# EAGLE board HW_RPI_DAQ (EAGLE 9.2.1), part 1 of 4
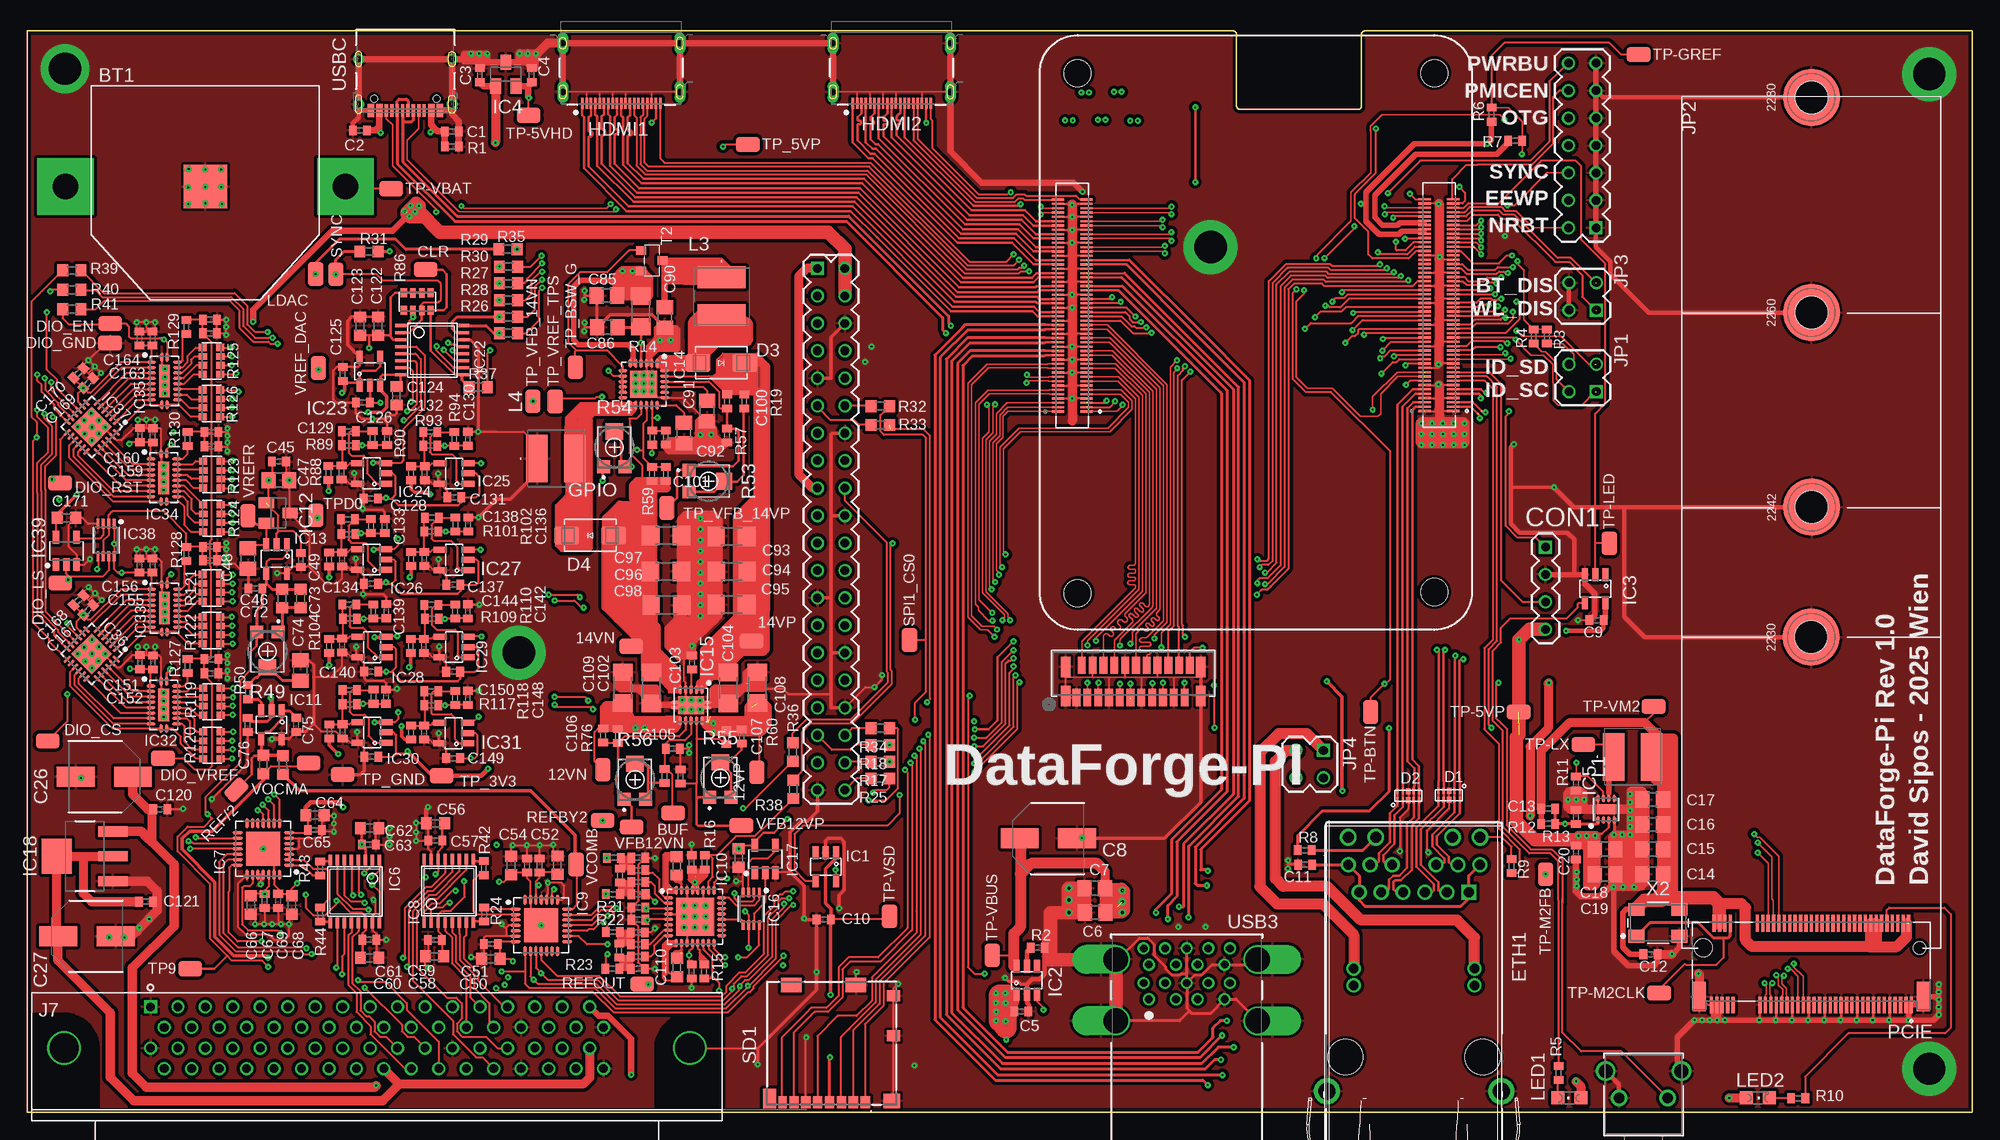
[diagram p8: board, top side]
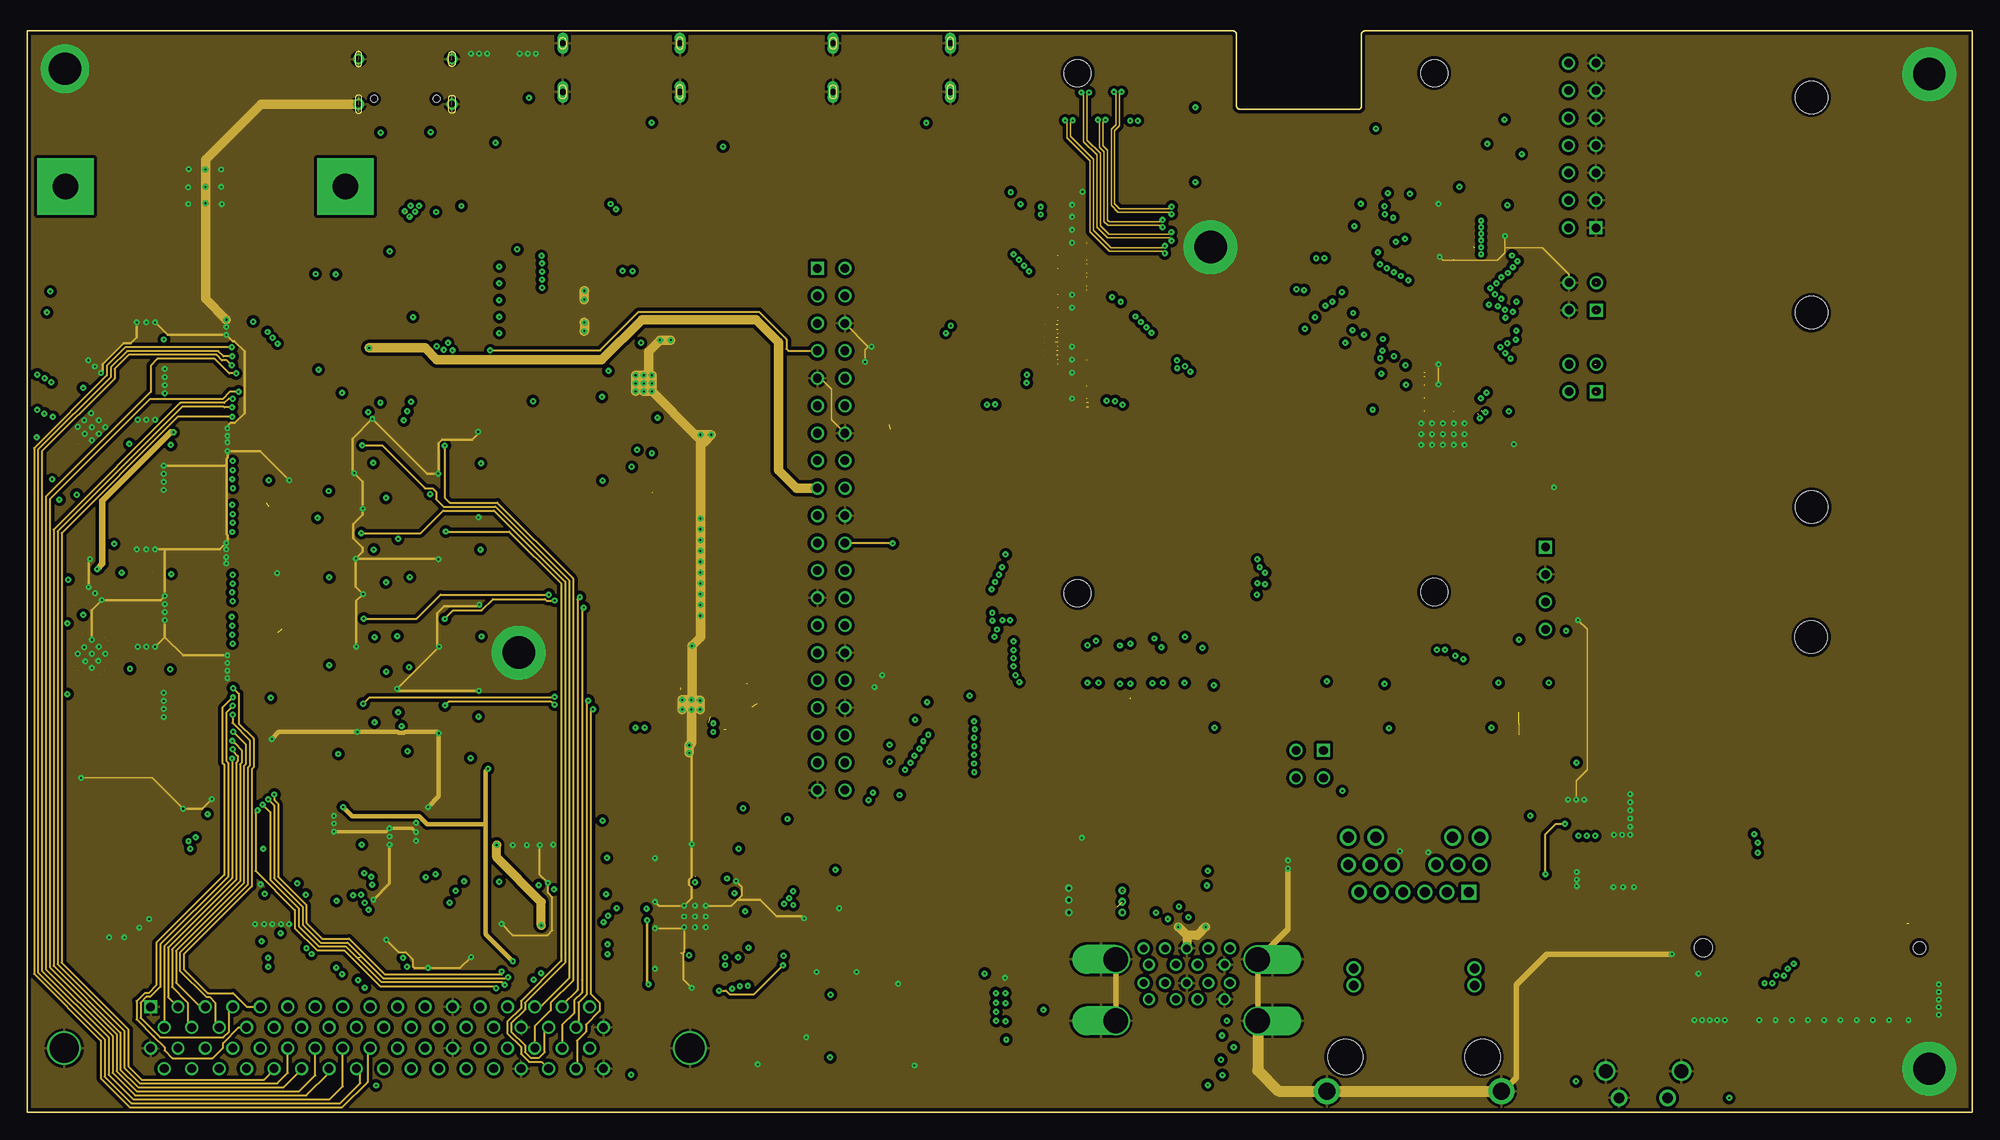
[diagram p9: board, inner layer Route2]
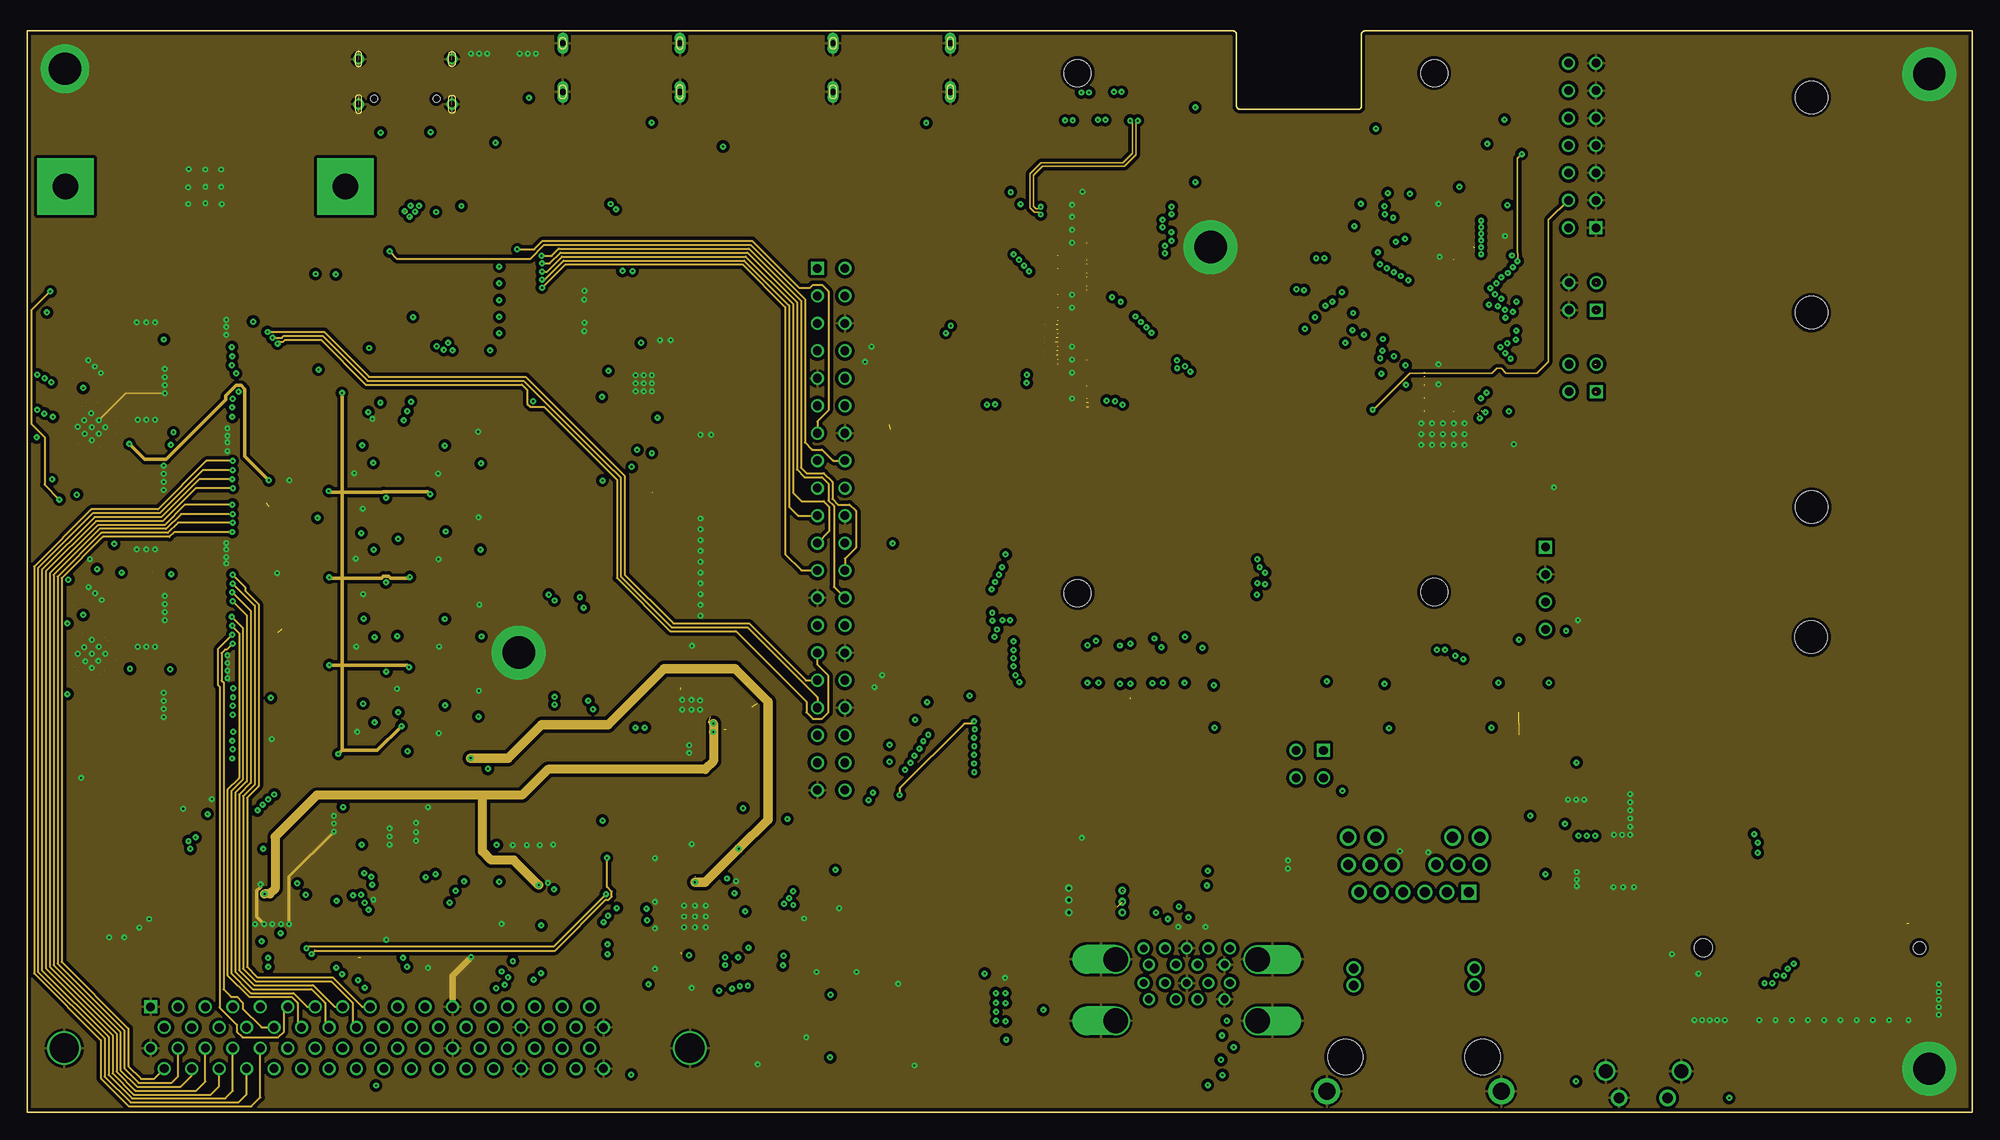
[diagram p10: board, inner layer Route15]
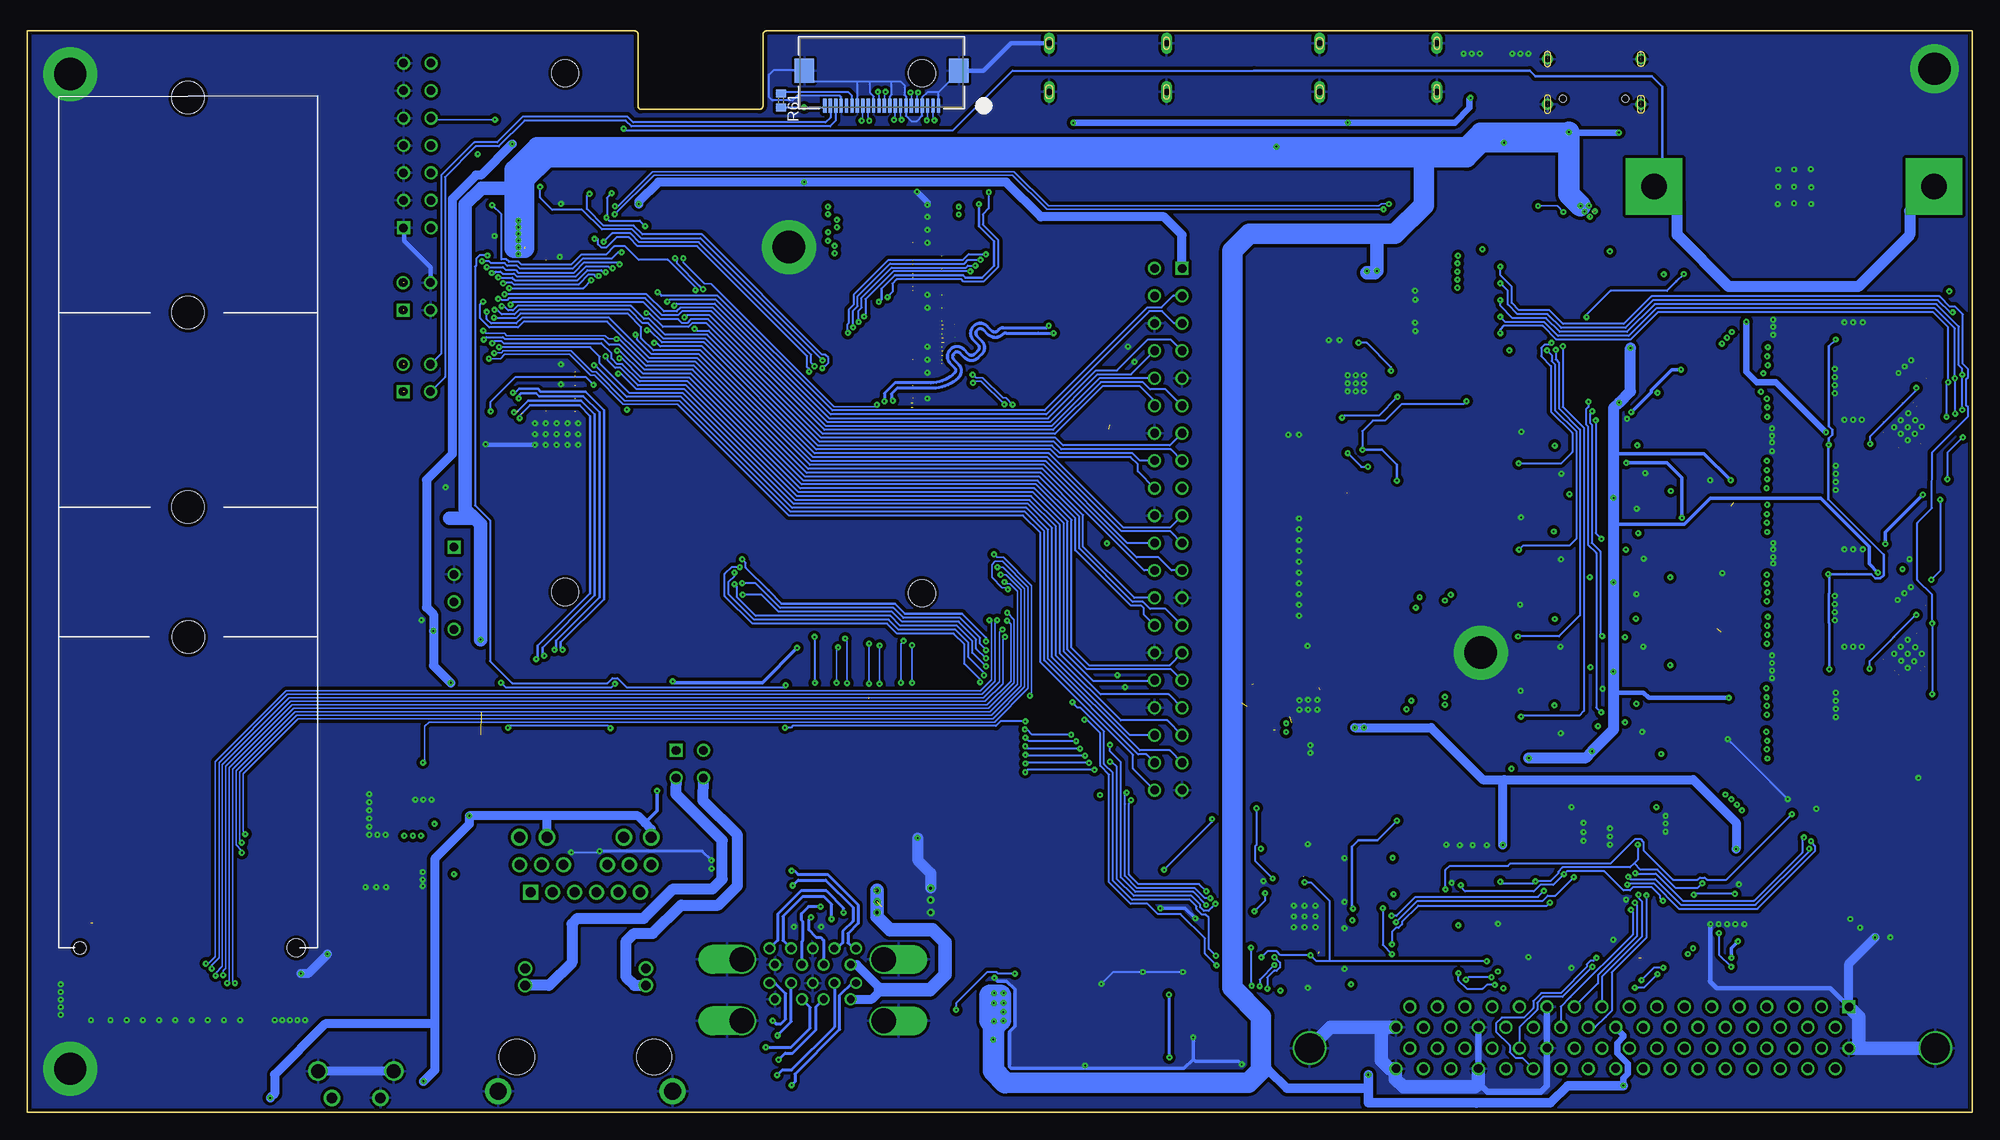
[diagram p11: board, bottom side, seen from below]

Size 180 x 100 mm. Coordinates in mm from the lower left corner, seen from the top.
Outline: 0,0 0,100 111.56,100 arc-90 111.9,99.66 111.9,93.09 arc90 112.24,92.75 123.2,92.75 arc90 123.45,93 123.45,99.66 arc-90 123.79,100 180,100 180,0 0,0
Copper layers (1+2*15+16): Top 0.035mm / dielectric 0.2104mm / Route2 0.0152mm / dielectric 1.065mm / Route15 0.0152mm / dielectric 0.2104mm / Bottom 0.035mm
Design rules "jlcpcb-4layers *": minimum track width 0.16mm, minimum drill 0.15mm, track to track 0.16mm, track to pad 0.16mm, pad to pad 0.16mm, via to via 0.16mm, smd to smd 0.16mm, copper to edge 0.2mm, drill to drill 0.2mm, minimum pad ring 0.2mm, minimum via ring 0.2mm, stop-mask expansion 0.05mm, vias tented up to drill 16mil, thermal gap 10mil
Net classes: 1 50R_DIFFPAIR: width 0.4 mm, drill 0.15 mm, clearance 0.203 mm; 2 90R_DIFFPAIR: width 0.286 mm, drill 0.15 mm, clearance 0.203 mm; 3 100R_DIFFPAIR: width 0.221 mm, drill 0.15 mm, clearance 0.203 mm
Holes 2.5 mm at 97.2,96.1 130.2,96.1 97.2,48 130.2,48.1

## Footprints (pad centres in the part's own frame; a part is rotated, then mirrored left to right if it is on the bottom)
TP = smd 2.2 x 1.4: TP 0,0
WA-SMSI_9774010243 = smd 5.3 x 5.3: 1 0,0 | hole 3: 0,0
79523141 = smd 4 x 4: N 0,0 | drill 2.35 pad 5.2 square: P1 -12.95,0; P2 12.95,0
0402 = smd 0.7 x 0.9: 1 -0.65,0; 2 0.65,0
0805 = smd 1.3 x 1.5: 1 -0.95,0; 2 0.95,0
100UF-16V = smd 3.5 x 1.85: 1 -2.65,0; 2 2.65,0
0603 = smd 1 x 1.1: 1 -0.85,0; 2 0.85,0
1206 = smd 1.6 x 1.803: 1 -1.422,0; 2 1.422,0
1X4 = drill 0.8 square: 1 0,3.81 | drill 0.8: 2 0,1.27; 3 0,-1.27; 4 0,-3.81
USON = smd 0.57 x 0.2: 1 -0.4,1; 2 -0.4,0.5; 4 -0.4,-0.5; 5 -0.4,-1; 6 0.435,-1; 7 0.435,-0.5; 9 0.435,0.5; 10 0.435,1 | smd 0.57 x 0.4: 3 -0.4,0; 8 0.435,0
SMA = smd 2.28 x 1.66: A 2.165,0; C -2.165,0
MAGJACK_POE = drill 1.02 pad 1.53: 17 6.11,15.24; 18 3.57,15.24; 19 -3.54,15.24; 20 -6.08,15.24 | drill 0.9 pad 1.4: CT1 -6.08,12.7; CT2 -5.07,10.16; CT4 6.1,12.7; TD1+ -4.05,12.7; TD1- -2.02,12.7; TD2+ -1.01,10.16; TD2- -3.04,10.16; TD3+ 1.02,10.16; TD3- 3.05,10.16; TD4+ 4.07,12.7; TD4- 2.04,12.7 | drill 0.9 pad 1.4 square: CT3 5.08,10.16 | drill 1.6 pad 2.4: MH3 -8.06,-8.25; MH4 8.08,-8.25 | drill 0.9 pad 1.25: VC1 5.6,3.1; VC2 -5.58,3.1; VC3 5.6,1.53; VC4 -5.58,1.53 | hole 3.25: -6.34,-5.08; 6.36,-5.08
2X20 = drill 0.8 square: 1 -1.27,24.13 | drill 0.8: 2 1.27,24.13; 3 -1.27,21.59; 4 1.27,21.59; 5 -1.27,19.05; 6 1.27,19.05; 7 -1.27,16.51; 8 1.27,16.51; 9 -1.27,13.97; 10 1.27,13.97; 11 -1.27,11.43; 12 1.27,11.43; 13 -1.27,8.89; 14 1.27,8.89; 15 -1.27,6.35; 16 1.27,6.35; 17 -1.27,3.81; 18 1.27,3.81; 19 -1.27,1.27; 20 1.27,1.27; 21 -1.27,-1.27; 22 1.27,-1.27; 23 -1.27,-3.81; 24 1.27,-3.81; 25 -1.27,-6.35; 26 1.27,-6.35; 27 -1.27,-8.89; 28 1.27,-8.89; 29 -1.27,-11.43; 30 1.27,-11.43; 31 -1.27,-13.97; 32 1.27,-13.97; 33 -1.27,-16.51; 34 1.27,-16.51; 35 -1.27,-19.05; 36 1.27,-19.05; 37 -1.27,-21.59; 38 1.27,-21.59; 39 -1.27,-24.13; 40 1.27,-24.13
685119136923 = smd 0.23 x 1: 1 3.6,1.05; 2 3.2,1.05; 3 2.8,1.05; 4 2.4,1.05; 5 2,1.05; 6 1.6,1.05; 7 1.2,1.05; 8 0.8,1.05; 9 0.4,1.05; 10 0,1.05; 11 -0.4,1.05; 12 -0.8,1.05; 13 -1.2,1.05; 14 -1.6,1.05; 15 -2,1.05; 16 -2.4,1.05; 17 -2.8,1.05; 18 -3.2,1.05; 19 -3.6,1.05 | drill 0.6 pad 0.9 long: S1 5.425,0; S2 -5.425,0 | drill 0.6 pad 0.8 long: S3 -5.425,-4.5; S4 5.425,-4.5
SOT23-5 = smd 0.55 x 1.2: 1 -0.95,-1.3; 2 0,-1.3; 3 0.95,-1.3; 4 0.95,1.3; 5 -0.95,1.3
SOT23-6 = smd 0.55 x 1.2: 1 -0.95,-1.3; 2 0,-1.3; 3 0.95,-1.3; 4 0.95,1.3; 5 0,1.3; 6 -0.95,1.3
SOT23 = smd 1 x 1.4: 1 -0.95,-1.1; 2 0.95,-1.1; 3 0,1.1
SON50P201X201X56-9T90X170N = smd 0.715 x 0.27: 1 -1.001,0.75; 2 -1.001,0.25; 3 -1.001,-0.25; 4 -1.001,-0.75; 5 1.001,-0.75; 6 1.001,-0.25; 7 1.001,0.25; 8 1.001,0.75 | smd 0.9 x 1.7: 9 0,0
TSSOP2 = smd 0.305 x 0.991: 1 -2.275,-2.918; 2 -1.625,-2.918; 3 -0.975,-2.918; 4 -0.325,-2.918; 5 0.325,-2.918; 6 0.975,-2.918; 7 1.625,-2.918; 8 2.275,-2.918; 9 2.275,2.918; 10 1.625,2.918; 11 0.975,2.918; 12 0.325,2.918; 13 -0.325,2.918; 14 -0.975,2.918; 15 -1.625,2.918; 16 -2.275,2.918
QFN50P500X500X75-29T314N = smd 0.968 x 0.27: 1 -2.381,1.5; 2 -2.381,1; 3 -2.381,0.5; 4 -2.381,0; 5 -2.381,-0.5; 6 -2.381,-1; 7 -2.381,-1.5; 15 2.381,-1.5; 16 2.381,-1; 17 2.381,-0.5; 18 2.381,0; 19 2.381,0.5; 20 2.381,1; 21 2.381,1.5 | smd 0.27 x 0.968: 8 -1.5,-2.381; 9 -1,-2.381; 10 -0.5,-2.381; 11 0,-2.381; 12 0.5,-2.381; 13 1,-2.381; 14 1.5,-2.381; 22 1.5,2.381; 23 1,2.381; 24 0.5,2.381; 25 0,2.381; 26 -0.5,2.381; 27 -1,2.381; 28 -1.5,2.381 | smd 3.14 x 3.14: 29 0,0
VQFN32-5X5 = smd 0.86 x 0.27: 1 -2.435,1.75; 2 -2.435,1.25; 3 -2.435,0.75; 4 -2.435,0.25; 5 -2.435,-0.25; 6 -2.435,-0.75; 7 -2.435,-1.25; 8 -2.435,-1.75; 17 2.435,-1.75; 18 2.435,-1.25; 19 2.435,-0.75; 20 2.435,-0.25; 21 2.435,0.25; 22 2.435,0.75; 23 2.435,1.25; 24 2.435,1.75 | smd 0.27 x 0.86: 9 -1.75,-2.435; 10 -1.25,-2.435; 11 -0.75,-2.435; 12 -0.25,-2.435; 13 0.25,-2.435; 14 0.75,-2.435; 15 1.25,-2.435; 16 1.75,-2.435; 25 1.75,2.435; 26 1.25,2.435; 27 0.75,2.435; 28 0.25,2.435; 29 -0.25,2.435; 30 -0.75,2.435; 31 -1.25,2.435; 32 -1.75,2.435 | smd 3.5 x 3.5: 33 0,0
VQFN24-4X4-THERMAL2.5X2.5 = smd 0.86 x 0.27: 1 -1.935,1.25; 2 -1.935,0.75; 3 -1.935,0.25; 4 -1.935,-0.25; 5 -1.935,-0.75; 6 -1.935,-1.25; 13 1.935,-1.25; 14 1.935,-0.75; 15 1.935,-0.25; 16 1.935,0.25; 17 1.935,0.75; 18 1.935,1.25 | smd 0.27 x 0.86: 7 -1.25,-1.935; 8 -0.75,-1.935; 9 -0.25,-1.935; 10 0.25,-1.935; 11 0.75,-1.935; 12 1.25,-1.935; 19 1.25,1.935; 20 0.75,1.935; 21 0.25,1.935; 22 -0.25,1.935; 23 -0.75,1.935; 24 -1.25,1.935 | smd 2.5 x 2.5: 25 0,0
WSON10-3X3 = smd 0.86 x 0.264: 1 -1.435,1; 2 -1.435,0.5; 3 -1.435,0; 4 -1.435,-0.5; 5 -1.435,-1; 6 1.435,-1; 7 1.435,-0.5; 8 1.435,0; 9 1.435,0.5; 10 1.435,1 | smd 1.65 x 2.4: PAD 0,0 | smd 0.264 x 0.86: PAD1 -0.25,1.435; PAD2 -0.25,-1.435; PAD3 0.25,-1.435; PAD4 0.25,1.435
SOP50P310X90-8N = smd 0.923 x 0.268: 1 -1.503,0.75; 2 -1.503,0.25; 3 -1.503,-0.25; 4 -1.503,-0.75; 5 1.503,-0.75; 6 1.503,-0.25; 7 1.503,0.25; 8 1.503,0.75
SOT95P280X145-5N = smd 1.186 x 0.597: 1 -1.264,0.95; 2 -1.264,0; 3 -1.264,-0.95; 4 1.264,-0.95; 5 1.264,0.95
SOT230 = smd 0.95 x 2.75: 1 -2.3,-2.6; 2 0,-2.6; 3 2.3,-2.6 | smd 3.25 x 2.75: 4 0,2.6
TSSOP16 = smd 0.305 x 0.991: 1 -2.275,-2.918; 2 -1.625,-2.918; 3 -0.975,-2.918; 4 -0.325,-2.918; 5 0.325,-2.918; 6 0.975,-2.918; 7 1.625,-2.918; 8 2.275,-2.918; 9 2.275,2.918; 10 1.625,2.918; 11 0.975,2.918; 12 0.325,2.918; 13 -0.325,2.918; 14 -0.975,2.918; 15 -1.625,2.918; 16 -2.275,2.918
VQFN20 = smd 0.27 x 0.838: 1 -0.25,2.196; 10 -0.25,-2.196; 11 0.25,-2.196; 20 0.25,2.196 | smd 0.838 x 0.27: 2 -1.196,1.75; 3 -1.196,1.25; 4 -1.196,0.75; 5 -1.196,0.25; 6 -1.196,-0.25; 7 -1.196,-0.75; 8 -1.196,-1.25; 9 -1.196,-1.75; 12 1.196,-1.75; 13 1.196,-1.25; 14 1.196,-0.75; 15 1.196,-0.25; 16 1.196,0.25; 17 1.196,0.75; 18 1.196,1.25; 19 1.196,1.75 | smd 1 x 3: PAD 0,0
QFN50P400X400X100-25T265 = smd 0.811 x 0.264: 1 -1.951,1.25; 2 -1.951,0.75; 3 -1.951,0.25; 4 -1.951,-0.25; 5 -1.951,-0.75; 6 -1.951,-1.25; 13 1.951,-1.25; 14 1.951,-0.75; 15 1.951,-0.25; 16 1.951,0.25; 17 1.951,0.75; 18 1.951,1.25 | smd 0.264 x 0.811: 7 -1.25,-1.951; 8 -0.75,-1.951; 9 -0.25,-1.951; 10 0.25,-1.951; 11 0.75,-1.951; 12 1.25,-1.951; 19 1.25,1.951; 20 0.75,1.951; 21 0.25,1.951; 22 -0.25,1.951; 23 -0.75,1.951; 24 -1.25,1.951 | smd 2.65 x 2.65: 25 0,0
AMPHENOL_10164227-1001A1RLF = smd 0.2 x 1.14: 1 9.8,1.32; 2 9.8,-1.32; 3 9.4,1.32; 4 9.4,-1.32; 5 9,1.32; 6 9,-1.32; 7 8.6,1.32; 8 8.6,-1.32; 9 8.2,1.32; 10 8.2,-1.32; 11 7.8,1.32; 12 7.8,-1.32; 13 7.4,1.32; 14 7.4,-1.32; 15 7,1.32; 16 7,-1.32; 17 6.6,1.32; 18 6.6,-1.32; 19 6.2,1.32; 20 6.2,-1.32; 21 5.8,1.32; 22 5.8,-1.32; 23 5.4,1.32; 24 5.4,-1.32; 25 5,1.32; 26 5,-1.32; 27 4.6,1.32; 28 4.6,-1.32; 29 4.2,1.32; 30 4.2,-1.32; 31 3.8,1.32; 32 3.8,-1.32; 33 3.4,1.32; 34 3.4,-1.32; 35 3,1.32; 36 3,-1.32; 37 2.6,1.32; 38 2.6,-1.32; 39 2.2,1.32; 40 2.2,-1.32; 41 1.8,1.32; 42 1.8,-1.32; 43 1.4,1.32; 44 1.4,-1.32; 45 1,1.32; 46 1,-1.32; 47 0.6,1.32; 48 0.6,-1.32; 49 0.2,1.32; 50 0.2,-1.32; 51 -0.2,1.32; 52 -0.2,-1.32; 53 -0.6,1.32; 54 -0.6,-1.32; 55 -1,1.32; 56 -1,-1.32; 57 -1.4,1.32; 58 -1.4,-1.32; 59 -1.8,1.32; 60 -1.8,-1.32; 61 -2.2,1.32; 62 -2.2,-1.32; 63 -2.6,1.32; 64 -2.6,-1.32; 65 -3,1.32; 66 -3,-1.32; 67 -3.4,1.32; 68 -3.4,-1.32; 69 -3.8,1.32; 70 -3.8,-1.32; 71 -4.2,1.32; 72 -4.2,-1.32; 73 -4.6,1.32; 74 -4.6,-1.32; 75 -5,1.32; 76 -5,-1.32; 77 -5.4,1.32; 78 -5.4,-1.32; 79 -5.8,1.32; 80 -5.8,-1.32; 81 -6.2,1.32; 82 -6.2,-1.32; 83 -6.6,1.32; 84 -6.6,-1.32; 85 -7,1.32; 86 -7,-1.32; 87 -7.4,1.32; 88 -7.4,-1.32; 89 -7.8,1.32; 90 -7.8,-1.32; 91 -8.2,1.32; 92 -8.2,-1.32; 93 -8.6,1.32; 94 -8.6,-1.32; 95 -9,1.32; 96 -9,-1.32; 97 -9.4,1.32; 98 -9.4,-1.32; 99 -9.8,1.32; 100 -9.8,-1.32
FH12-22S-0.5SH = smd 0.711 x 1.6: 1 5.251,2.244; 2 4.751,-0.756; 3 4.251,2.244; 4 3.751,-0.756; 5 3.251,2.244; 6 2.751,-0.756; 7 2.251,2.244; 8 1.75,-0.756; 9 1.25,2.244; 10 0.75,-0.756; 11 0.25,2.244; 12 -0.25,-0.756; 13 -0.75,2.244; 14 -1.25,-0.756; 15 -1.75,2.244; 16 -2.251,-0.756; 17 -2.751,2.244; 18 -3.251,-0.756; 19 -3.751,2.244; 20 -4.251,-0.756; 21 -4.751,2.244; 22 -5.251,-0.756 | smd 0.889 x 1.905: 23 -6.25,2.091; 24 6.25,2.091; 25 -6.25,-0.604; 26 6.25,-0.604
CONN_FH12-22S-0.5SH(55)_HIR = smd 0.305 x 1.295: 1 -5.25,3.05; 2 -4.75,3.05; 3 -4.25,3.05; 4 -3.75,3.05; 5 -3.25,3.05; 6 -2.75,3.05; 7 -2.25,3.05; 8 -1.75,3.05; 9 -1.25,3.05; 10 -0.75,3.05; 11 -0.25,3.05; 12 0.25,3.05; 13 0.75,3.05; 14 1.25,3.05; 15 1.75,3.05; 16 2.25,3.05; 17 2.75,3.05; 18 3.25,3.05; 19 3.75,3.05; 20 4.25,3.05; 21 4.75,3.05; 22 5.25,3.05 | smd 1.803 x 2.21: 23 -7.15,-0.2; 24 7.15,-0.2
2-5174225-5 = drill 0.8 square: 1 0,0 | drill 0.8: 2 1.27,-1.905; 3 2.54,0; 4 3.81,-1.905; 5 5.08,0; 6 6.35,-1.905; 7 7.62,0; 8 8.89,-1.905; 9 10.16,0; 10 11.43,-1.905; 11 12.7,0; 12 13.97,-1.905; 13 15.24,0; 14 16.51,-1.905; 15 17.78,0; 16 19.05,-1.905; 17 20.32,0; 18 21.59,-1.905; 19 22.86,0; 20 24.13,-1.905; 21 25.4,0; 22 26.67,-1.905; 23 27.94,0; 24 29.21,-1.905; 25 30.48,0; 26 31.75,-1.905; 27 33.02,0; 28 34.29,-1.905; 29 35.56,0; 30 36.83,-1.905; 31 38.1,0; 32 39.37,-1.905; 33 40.64,0; 34 41.91,-1.905; 35 0,-3.81; 36 1.27,-5.715; 37 2.54,-3.81; 38 3.81,-5.715; 39 5.08,-3.81; 40 6.35,-5.715; 41 7.62,-3.81; 42 8.89,-5.715; 43 10.16,-3.81; 44 11.43,-5.715; 45 12.7,-3.81; 46 13.97,-5.715; 47 15.24,-3.81; 48 16.51,-5.715; 49 17.78,-3.81; 50 19.05,-5.715; 51 20.32,-3.81; 52 21.59,-5.715; 53 22.86,-3.81; 54 24.13,-5.715; 55 25.4,-3.81; 56 26.67,-5.715; 57 27.94,-3.81; 58 29.21,-5.715; 59 30.48,-3.81; 60 31.75,-5.715; 61 33.02,-3.81; 62 34.29,-5.715; 63 35.56,-3.81; 64 36.83,-5.715; 65 38.1,-3.81; 66 39.37,-5.715; 67 40.64,-3.81; 68 41.91,-5.715 | drill 2.7: MH1 -7.995,-3.81; MH2 49.905,-3.81
2X2 = drill 0.8 square: 1 -1.27,1.27 | drill 0.8: 2 1.27,1.27; 3 -1.27,-1.27; 4 1.27,-1.27
2X7 = drill 0.8 square: 1 -1.27,7.62 | drill 0.8: 2 1.27,7.62; 3 -1.27,5.08; 4 1.27,5.08; 5 -1.27,2.54; 6 1.27,2.54; 7 -1.27,0; 8 1.27,0; 9 -1.27,-2.54; 10 1.27,-2.54; 11 -1.27,-5.08; 12 1.27,-5.08; 13 -1.27,-7.62; 14 1.27,-7.62
SRR5228A = smd 4.4 x 2: 1 0,1.75; 2 0,-1.75
CHIPLED_0805 = smd 1.2 x 1.2: A 0,-1.05; C 0,1.05
M.2 = smd 0.3 x 1.55: 1 9.25,-4.005; 2 9,3.545; 3 8.75,-4.005; 4 8.5,3.545; 5 8.25,-4.005; 6 8,3.545; 7 7.75,-4.005; 8 7.5,3.545; 9 7.25,-4.005; 10 7,3.545; 11 6.75,-4.005; 12 6.5,3.545; 13 6.25,-4.005; 14 6,3.545; 15 5.75,-4.005; 16 5.5,3.545; 17 5.25,-4.005; 18 5,3.545; 19 4.75,-4.005; 20 4.5,3.545; 21 4.25,-4.005; 22 4,3.545; 23 3.75,-4.005; 24 3.5,3.545; 25 3.25,-4.005; 26 3,3.545; 27 2.75,-4.005; 28 2.5,3.545; 29 2.25,-4.005; 30 2,3.545; 31 1.75,-4.005; 32 1.5,3.545; 33 1.25,-4.005; 34 1,3.545; 35 0.75,-4.005; 36 0.5,3.545; 37 0.25,-4.005; 38 0,3.545; 39 -0.25,-4.005; 40 -0.5,3.545; 41 -0.75,-4.005; 42 -1,3.545; 43 -1.25,-4.005; 44 -1.5,3.545; 45 -1.75,-4.005; 46 -2,3.545; 47 -2.25,-4.005; 48 -2.5,3.545; 49 -2.75,-4.005; 50 -3,3.545; 51 -3.25,-4.005; 52 -3.5,3.545; 53 -3.75,-4.005; 54 -4,3.545; 55 -4.25,-4.005; 56 -4.5,3.545; 57 -4.75,-4.005; 58 -5,3.545; 67 -7.25,-4.005; 68 -7.5,3.545; 69 -7.75,-4.005; 70 -8,3.545; 71 -8.25,-4.005; 72 -8.5,3.545; 73 -8.75,-4.005; 74 -9,3.545; 75 -9.25,-4.005 | smd 1.2 x 2.75: S1 10.35,-3.23; S2 -10.35,-3.23 | hole 1.15: 10,1.27 | hole 1.65: -10,1.27
TC33X = smd 1.2 x 1.2: 1 -1,-1.8; 3 1,-1.8 | smd 1.6 x 1.5: 2 0,1.45
YC164-JR-0733RL = smd 0.67 x 0.85: 1 -1.24,-0.81; 4 1.24,-0.81; 5 1.24,0.81; 8 -1.24,0.81 | smd 0.59 x 0.85: 2 -0.4,-0.81; 3 0.4,-0.81; 6 0.4,0.81; 7 -0.4,0.81
MICROSD = smd 0.85 x 1.1: CLK -1.295,-5.294; CMD 0.905,-5.294; DAT0 -3.495,-5.294; DAT2 3.105,-5.294; DAT3/CD 2.005,-5.294; VDD -0.195,-5.294; VSS -2.395,-5.294 | smd 0.75 x 1.1: DAT1 -4.545,-5.294 | smd 1.17 x 1.8: DET1 -5.755,-4.944 | smd 1.9 x 1.35: DET2 -3.73,5.531; MT1 2.24,5.531 | smd 1.2 x 1: MT2 5.74,4.556; MT3 5.74,0.856 | smd 1.55 x 1.35: MT4 5.565,-5.169
SW2_1825027-C_TEC = drill 0.991 pad 1.499: 1 0,0; 2 4.496,0 | drill 1.295 pad 1.803: 3 -1.245,2.489; 4 5.766,2.489
MICRO3 = smd 0.8 x 0.9: 1 -0.95,-1; 2 0.95,-1; 3 0,1
692141030100 = drill 0.7: 1 -3.5,3.93; 2 -1,3.93; 3 1,3.93; 4 3.5,3.93; 5 4,5.43; 6 2,5.43; 7 0,5.43; 8 -2,5.43; 9 -4,5.43; 10 -3.5,7.13; 11 -1,7.13; 12 1,7.13; 13 3.5,7.13; 14 4,8.63; 15 2,8.63; 16 0,8.63; 17 -2,8.63; 18 -4,8.63 | drill 2.3 offset: S1 -6.57,7.61; S2 6.57,7.61; S3 6.57,1.93; S4 -6.57,1.93
629722000214 = smd 0.3 x 1.15: A1 -3.35,4.745; A4 -2.55,4.745; A5 -1.25,4.745; A6 -0.25,4.745; A7 0.25,4.745; A8 1.25,4.745; A9 2.55,4.745; A12 3.35,4.745; B1 3.05,4.745; B4 2.25,4.745; B5 1.75,4.745; B6 0.75,4.745; B7 -0.75,4.745; B8 -1.75,4.745; B9 -2.25,4.745; B12 -3.05,4.745 | drill 0.6 pad 1: S1 -4.32,4.18; S2 4.32,4.18; S3 -4.32,0; S4 4.32,0 | hole 0.65: -2.89,3.68; 2.89,3.68
OSCCC500X320X130 = smd 1.487 x 1.187: 1 -1.988,-1.238; 2 1.988,-1.238; 3 1.988,1.238; 4 -1.988,1.238

## Placement (x,y rotation side)
12VN  TP  [TP]  53.28,31.66 270 top
12VP  TP  [TP]  67.53,31.42 270 top
14VN  TP  [TP]  55.9,43.08 180 top
14VP  TP  [TP]  67.03,43.58 0 top
2230  M2 x 1mm  [WA-SMSI_9774010243]  165.08,43.92 90 top
2242  M2 x 1mm  [WA-SMSI_9774010243]  165.13,55.95 90 top
2260  M2 x 1mm  [WA-SMSI_9774010243]  165.09,73.95 90 top
2280  M2 x 1mm  [WA-SMSI_9774010243]  165.09,93.86 90 top
BT1  79523141  [79523141]  16.5,85.6 0 top
BUF  TP  [TP]  59.77,27.68 0 top
C1  [0402]  39.3,90.7 0 top
C2  [0402]  30.8,90.8 180 top
C3  100nF  [0402]  41.9,95.9 90 top
C4  100nF  [0402]  46.7,95.9 90 top
C5  100nF  [0402]  92,9.3 0 top
C6  10uF  [0805]  98.85,18.45 180 top
C7  10uF  [0805]  98.8,20.7 180 top
C8  100uF 16V  [100UF-16V]  94.5,25.3 0 top
C9  100nF  [0402]  145.2,45.5 180 top
C10  100nF  [0402]  73.7,17.8 180 top
C11  100nF  [0402]  118.25,22.88 180 top
C12  100nF  [0402]  150.2,14.6 0 top
C13  4.7nF  [0402]  140.75,28.05 0 top
C14  10uF  [0805]  150.4,22 180 top
C15  10uF  [0805]  150.4,24.3 180 top
C16  10uF  [0805]  150.4,26.6 180 top
C17  10uF  [0805]  150.4,28.9 180 top
C18  10uF  [0805]  146,24.3 0 top
C19  10uF  [0805]  146,22 0 top
C20  100nF  [0402]  143.3,24 270 top
C21  100nF  [0603]  65.85,23.5 270 top
C22  100nF  [0402]  61.5,23.1 90 top
C23  270pF  [0402]  56.57,23.52 0 top
C24  270pF  [0402]  56.58,20.14 180 top
C25  100nF  [0402]  61.5,13 270 top
C26  100uF 16V  [100UF-16V]  7.15,31 180 top
C27  100uF 16V  [100UF-16V]  5.55,16.25 0 top
C41  680pF  [0402]  54.86,21.88 270 top
C42  270pF  [0402]  56.52,16.61 0 top
C43  270pF  [0402]  56.53,13.23 180 top
C44  680pF  [0402]  54.8,14.95 270 top
C45  100nF  [0402]  23.32,60.16 0 top
C46  100nF  [0402]  21.14,48.44 180 top
C47  10uF  [0805]  23.32,58.44 0 top
C48  [0805]  20.45,51.2 270 top
C49  100nF  [0402]  25.34,51.06 270 top
C50  1uF  [0603]  42.92,14.18 180 top
C51  100nF  [0402]  42.92,15.54 180 top
C52  1uF  [0603]  49.08,22.83 90 top
C53  100nF  [0402]  47.44,22.81 90 top
C54  1uF  [0603]  44.8,22.8 90 top
C55  100nF  [0402]  46.27,22.8 90 top
C56  1uF  [0603]  37.8,26.7 180 top
C57  100nF  [0402]  37.77,25.11 180 top
C58  1uF  [0603]  37.7,14.39 180 top
C59  100nF  [0402]  37.74,15.91 180 top
C60  1uF  [0603]  31.7,14.26 0 top
C61  100nF  [0402]  31.69,15.94 0 top
C62  1uF  [0603]  31.7,26.25 0 top
C63  100nF  [0402]  31.62,24.73 0 top
C64  1uF  [0603]  26.65,27.45 0 top
C65  100nF  [0402]  26.65,26.09 0 top
C66  1uF  [0603]  20.7,19.15 270 top
C67  100nF  [0402]  21.98,19.52 270 top
C68  1uF  [0603]  24.5,19.15 270 top
C69  100nF  [0402]  23.23,19.54 270 top
C70  10uF  [0603]  60.12,22.77 90 top
C71  100nF  [0402]  56.56,18.91 180 top
C72  1uF  [0603]  23.61,47.5 270 top
C73  100nF  [0603]  25.32,47.5 270 top
C74  [0805]  25.3,40.85 90 top
C75  100nF  [0402]  24.91,35.82 270 top
C76  100nF  [0402]  20.41,35.79 270 top
C85  4.7uF  [0805]  53.63,75.52 180 top
C86  100nF  [0805]  53.71,72.6 180 top
C90  10uF  [0805]  59.01,73.5 270 top
C91  10nF  [0805]  62.92,64.86 270 top
C92  4.7nF  [0805]  60.77,62.79 270 top
C93  22uF  [1206]  65.18,53.25 180 top
C94  22uF  [1206]  65.19,49.98 180 top
C95  22uF  [1206]  65.18,46.93 180 top
C96  22uF  [1206]  59.11,50 0 top
C97  22uF  [1206]  59.13,53.32 0 top
C98  22uF  [1206]  59.16,46.88 0 top
C99  220nF  [0402]  59.11,62.4 90 top
C100  10pF  [0402]  64.78,65.74 270 top
C101  10pF  [0402]  59.1,59.01 90 top
C102  10uF  [1206]  57.77,39.22 270 top
C103  10nF  [0402]  61.53,41.58 90 top
C104  10uF  [1206]  64.87,39.22 270 top
C105  220nF  [0402]  59.75,33.59 180 top
C106  10nF  [0402]  53.31,34.82 270 top
C107  10nF  [0402]  64.69,34.7 90 top
C108  22uF  [1206]  67.58,39.25 90 top
C109  22uF  [1206]  55.12,39.25 90 top
C110  10uF  [0603]  60.13,13.36 270 top
C111  100nF  [0402]  56.56,17.79 180 top
C120  100nF  [0402]  12.32,28 0 top
C121  100nF  [0402]  11.01,19.45 0 top
C122  1uF  [0603]  32.48,72.69 90 top
C123  100nF  [0603]  30.82,72.69 90 top
C124  1uF  [0603]  34.19,66.25 270 top
C125  100nF  [0402]  29.21,68.28 90 top
C126  100nF  [0402]  31.07,65.62 180 top
C127  20nF  [0402]  33.33,62.34 90 top
C128  100nF  [0402]  31.8,56.74 180 top
C129  100nF  [0402]  29.8,62.98 0 top
C130  20nF  [0402]  40.8,62.27 90 top
C131  100nF  [0402]  39.53,56.88 180 top
C132  100nF  [0402]  37.31,62.9 0 top
C133  20nF  [0402]  33.11,54.2 90 top
C134  100nF  [0402]  31.84,48.85 180 top
C135  100nF  [0402]  29.7,54.83 0 top
C136  20nF  [0402]  40.83,54.34 90 top
C137  100nF  [0402]  39.47,48.77 180 top
C138  100nF  [0402]  37.45,54.97 0 top
C139  20nF  [0402]  33.24,46.33 90 top
C140  100nF  [0402]  31.84,40.73 180 top
C141  100nF  [0402]  29.82,46.95 0 top
C142  20nF  [0402]  40.8,46.31 90 top
C143  100nF  [0402]  39.42,40.73 180 top
C144  100nF  [0402]  37.42,46.91 0 top
C145  20nF  [0402]  33.22,38.41 90 top
C146  100nF  [0402]  31.86,32.85 180 top
C147  100nF  [0402]  29.86,39.03 0 top
C148  20nF  [0402]  40.78,38.31 90 top
C149  100nF  [0402]  39.42,32.73 180 top
C150  100nF  [0402]  37.41,38.91 0 top
C151  1uF  [0402]  10.45,41.6 90 top
C152  100nF  [0402]  11.65,41.59 90 top
C153  1uF  [0402]  17.07,40.59 0 top
C154  100nF  [0402]  17.07,41.9 0 top
C155  1uF  [0402]  11.62,50.53 90 top
C156  100nF  [0402]  10.4,50.55 90 top
C157  1uF  [0402]  16.93,52.27 0 top
C158  100nF  [0402]  16.91,51.03 0 top
C159  1uF  [0402]  11.64,62.59 90 top
C160  100nF  [0402]  10.45,62.6 90 top
C161  1uF  [0402]  17.07,61.59 0 top
C162  100nF  [0402]  17.07,62.91 0 top
C163  1uF  [0402]  11.62,71.53 90 top
C164  100nF  [0402]  10.4,71.55 90 top
C165  1uF  [0402]  16.93,73.28 0 top
C166  100nF  [0402]  16.91,72.03 0 top
C167  1uF  [0402]  5.66,46.44 45 top
C168  100nF  [0402]  4.76,47.33 45 top
C169  1uF  [0402]  5.66,67.44 45 top
C170  100nF  [0402]  4.75,68.35 45 top
C171  100nF  [0603]  3.66,54.95 0 top
CLR  TP  [TP]  36.88,77.92 0 top
CON1  [1X4]  140.5,48.45 0 top
D1  TPD4EUSB30  [USON]  131.57,29.3 270 top
D2  TPD4EUSB30  [USON]  127.8,29.25 90 top
D3  SS12  [SMA]  64.25,69.29 180 top
D4  SS12  [SMA]  52.1,53.34 0 top
DIO_CS  TP  [TP]  1.93,34.33 0 top
DIO_EN  TP  [TP]  7.7,72.95 180 top
DIO_GND  TP  [TP]  7.68,71.12 180 top
DIO_LS  TP  [TP]  3.07,48.92 180 top
DIO_RST  TP  [TP]  3.05,58.17 180 top
DIO_VREF  TP  [TP]  12.57,32.73 180 top
ETH1  G16LX-188S7-1G-GO-Y  [MAGJACK_POE]  128.32,10.18 0 top
GPIO  [2X20]  74.4,53.9 0 top
HDMI1  685119136923  [685119136923]  54.98,94.36 180 top
HDMI2  685119136923  [685119136923]  80,94.36 180 top
IC1  [SOT23-5]  73.9,22.7 180 top
IC2  AP22653W6  [SOT23-6]  92.5,12.2 0 top
IC3  74LVC1G07  [SOT23-5]  145.1,48.4 180 top
IC4  RT9742NGV  [SOT23]  44.3,96 0 top
IC5  [SON50P201X201X56-9T90X170N]  146.1,28 90 top
IC6  DG409  [TSSOP2]  30.34,20.39 180 top
IC7  ADA4254ACPZ  [QFN50P500X500X75-29T314N]  21.86,24.34 180 top
IC8  DG409  [TSSOP2]  39.02,20.45 0 top
IC9  ADA4254ACPZ  [QFN50P500X500X75-29T314N]  47.58,17.27 0 top
IC10  ADS9234RIRHBR  [VQFN32-5X5]  61.81,18.07 0 top
IC11  MCP6001RT  [SOT23-5]  22.62,35.8 180 top
IC12  MCP1525T-I/TT  [SOT23]  23.25,55.4 270 top
IC13  MCP6001RT  [SOT23-5]  23.09,51.16 180 top
IC14  TPS65131  [VQFN24-4X4-THERMAL2.5X2.5]  57.06,67.32 270 top
IC15  TPS7A39  [WSON10-3X3]  61.44,37.64 270 top
IC16  SN74LVC2G66  [SOP50P310X90-8N]  67,18.8 270 top
IC17  74LVC1G04  [SOT95P280X145-5N]  68.3,23.4 90 top
IC18  [SOT230]  5.35,23.65 90 top
IC22  DAC8568  [TSSOP16]  37.49,70.47 270 top
IC23  MCP6001RT  [SOT23-5]  31.73,68.53 0 top
IC24  MCP6001RT  [SOT23-5]  31.88,59.08 90 top
IC25  MCP6001RT  [SOT23-5]  39.51,59.06 90 top
IC26  MCP6001RT  [SOT23-5]  31.89,51.1 90 top
IC27  MCP6001RT  [SOT23-5]  39.51,51.08 90 top
IC28  MCP6001RT  [SOT23-5]  31.93,42.99 90 top
IC29  MCP6001RT  [SOT23-5]  39.51,43.01 90 top
IC30  MCP6001RT  [SOT23-5]  31.93,35.12 90 top
IC31  MCP6001RT  [SOT23-5]  39.48,35.05 90 top
IC32  LSF0108  [VQFN20]  12.65,37.66 0 top
IC33  LSF0108  [VQFN20]  12.71,46.6 0 top
IC34  LSF0108  [VQFN20]  12.65,58.66 0 top
IC35  LSF0108  [VQFN20]  12.71,67.61 0 top
IC36  MCP23S18  [QFN50P400X400X100-25T265]  5.98,42.37 225 top
IC37  [QFN50P400X400X100-25T265]  5.98,63.36 225 top
IC38  SN74LVC2G66  [SOP50P310X90-8N]  7.32,52.9 270 top
IC39  74LVC1G04  [SOT95P280X145-5N]  3.64,51.91 90 top
J1  10164227-1001A1RLF  [AMPHENOL_10164227-1001A1RLF]  96.7,74.6 270 top
J2  10164227-1001A1RLF  [AMPHENOL_10164227-1001A1RLF]  130.64,74.64 270 top
J3  FH12-22S-0.5SVA  [FH12-22S-0.5SH]  102.35,40.58 180 top
J4  FH12-22S-0.5SH(55)  [CONN_FH12-22S-0.5SH(55)_HIR]  100.92,96.12 180 bottom
J7  2-5174225-5  [2-5174225-5]  11.43,9.72 0 top
JP1  [2X2]  143.94,67.9 180 top
JP2  [2X7]  143.9,89.4 180 top
JP3  [2X2]  143.94,75.45 180 top
JP4  POE  [2X2]  118.68,32.17 270 top
L1  L  [SRR5228A]  148.55,32.85 90 top
L3  SRR5228A-4R7Y  [SRR5228A]  64.26,75.46 0 top
L4  SRR5228A-4R7Y  [SRR5228A]  48.93,60.44 90 top
LDAC  TP  [TP]  26.7,77.52 270 top
LED1  Green  [CHIPLED_0805]  142.7,1.3 90 top
LED2  [CHIPLED_0805]  160.14,1.3 270 top
PCIE  M.2  [M.2]  165.09,13.91 0 top
R1  2.2K 1%  [0402]  39.3,89.3 0 top
R2  15K 1%  [0402]  93.5,15.2 0 top
R3  2.2K 1%  [0402]  140.63,71.73 270 top
R4  2.2K 1%  [0402]  139.39,71.74 270 top
R5  1K  [0402]  141.7,3.6 90 top
R6  0R  [0402]  135.5,92.25 90 top
R7  DNI  [0402]  137.7,89.85 0 top
R8  470R  [0402]  118.22,24.23 0 top
R9  470R  [0402]  137.35,22.75 270 top
R10  [0402]  163.88,1.28 0 top
R11  100K 1%  [0402]  143.3,30.4 270 top
R12  10K 1%  [0402]  140.75,26.65 0 top
R13  2.2K 1%  [0402]  143.3,27.3 90 top
R14  100R  [1206]  56.81,74.06 90 top
R15  0R  [0402]  62.66,12.98 90 top
R16  10K  [0402]  62.7,23.1 90 top
R17  0R  [0603]  78.95,32.4 180 top
R18  0R  [0603]  78.95,33.95 180 top
R19  950K 0.1%  [0402]  66.36,65.72 270 top
R20  200R  [0402]  54.3,23.5 180 top
R21  200R  [0402]  54.22,20.16 180 top
R22  200R  [0402]  54.19,16.66 180 top
R23  200R  [0402]  54.16,13.26 180 top
R24  0R  [0402]  42.3,18.28 270 top
R25  0R  [0603]  78.95,30.85 180 top
R26  0R  [0603]  44.55,72.05 0 top
R27  0R  [0603]  44.55,75.1 0 top
R28  0R  [0603]  44.55,73.55 0 top
R29  0R  [0603]  44.55,78.2 0 top
R30  0R  [0603]  44.55,76.65 0 top
R31  0R  [0603]  31.65,79.6 0 top
R32  0R  [0603]  78.95,65.3 180 top
R33  0R  [0603]  78.95,63.55 180 top
R34  0R  [0603]  78.95,35.5 180 top
R35  0R  [0603]  44.5,79.8 0 top
R36  0R  [0603]  70.85,33.3 90 top
R37  0R  [0603]  41.75,67.05 0 top
R38  0R  [0603]  70.9,29.85 90 top
R39  0R  [0603]  4.15,77.85 0 top
R40  0R  [0603]  4.15,76.05 0 top
R41  0R  [0603]  4.15,74.25 0 top
R42  0R  [0402]  42.27,22.55 270 top
R43  0R  [0402]  27.12,22.53 90 top
R44  0R  [0402]  27.12,18.26 90 top
R45  0R  [0402]  56.56,22.38 180 top
R46  0R  [0402]  56.57,21.27 0 top
R47  0R  [0402]  56.5,15.53 0 top
R48  0R  [0402]  56.52,14.38 180 top
R49  [TC33X]  22.25,42.6 180 top
R50  100R  [0402]  20.45,38.83 270 top
R51  0R  [0603]  21.88,32.14 270 top
R52  0R  [0603]  23.68,32.09 90 top
R53  [TC33X]  63.05,58.35 270 top
R54  [TC33X]  54.35,61.5 0 top
R55  [TC33X]  64.15,30.9 0 top
R56  [TC33X]  56.25,30.75 0 top
R57  102K 0.1%  [0402]  64.78,62.57 270 top
R58  1.2M 0.1%  [0402]  57.86,62.37 270 top
R59  137K 0.1%  [0402]  57.84,59.03 270 top
R60  75K 0.1%  [0402]  66.13,34.73 270 top
R61  2.2K 1%  [0402]  110.22,93.58 270 bottom
R73  10K 0.1%  [0402]  60.47,31.04 90 top
R74  90K 0.1%  [0402]  58.98,31.09 270 top
R76  10K 0.1%  [0402]  54.67,34.78 90 top
R86  CRA034RF100RP05Z  [YC164-JR-0733RL]  36.12,74.95 0 top
R87  10K 0.1%  [0402]  29.12,59.15 90 top
R88  10K 0.1%  [0402]  27.89,59.12 90 top
R89  43K 0.1%  [0402]  29.8,61.66 0 top
R90  68R 1%  [0402]  31.98,62.34 270 top
R91  10K 0.1%  [0402]  36.8,59.09 90 top
R92  10K 0.1%  [0402]  35.55,59.09 90 top
R93  43K 0.1%  [0402]  37.33,61.63 0 top
R94  68R 1%  [0402]  39.53,62.26 270 top
R95  10K 0.1%  [0402]  29.16,51.1 90 top
R96  10K 0.1%  [0402]  27.95,51.1 90 top
R97  43K 0.1%  [0402]  29.73,53.45 0 top
R98  68R 1%  [0402]  31.82,54.2 270 top
R99  10K 0.1%  [0402]  36.77,51.16 90 top
R100  10K 0.1%  [0402]  35.55,51.16 90 top
R101  43K 0.1%  [0402]  37.41,53.7 0 top
R102  68R 1%  [0402]  39.64,54.35 270 top
R103  10K 0.1%  [0402]  29.16,43.13 90 top
R104  10K 0.1%  [0402]  27.95,43.12 90 top
R105  43K 0.1%  [0402]  29.87,45.62 0 top
R106  68R 1%  [0402]  32.05,46.3 270 top
R107  10K 0.1%  [0402]  36.73,43.1 90 top
R108  10K 0.1%  [0402]  35.52,43.1 90 top
R109  43K 0.1%  [0402]  37.45,45.62 0 top
R110  68R 1%  [0402]  39.62,46.3 270 top
R111  10K 0.1%  [0402]  29.2,35.22 90 top
R112  10K 0.1%  [0402]  27.98,35.2 90 top
R113  43K 0.1%  [0402]  29.86,37.73 0 top
R114  68R 1%  [0402]  32.06,38.41 270 top
R115  10K 0.1%  [0402]  36.73,35.09 90 top
R116  10K 0.1%  [0402]  35.53,35.09 90 top
R117  43K 0.1%  [0402]  37.42,37.63 0 top
R118  68R 1%  [0402]  39.62,38.3 270 top
R119  YC164-JR-0733RL  [YC164-JR-0733RL]  17.12,37.95 270 top
R120  YC164-JR-0733RL  [YC164-JR-0733RL]  17.12,33.92 270 top
R121  YC164-JR-0733RL  [YC164-JR-0733RL]  17.07,48.48 270 top
R122  YC164-JR-0733RL  [YC164-JR-0733RL]  17.07,44.55 270 top
R123  YC164-JR-0733RL  [YC164-JR-0733RL]  17.12,58.95 270 top
R124  YC164-JR-0733RL  [YC164-JR-0733RL]  17.12,54.92 270 top
R125  YC164-JR-0733RL  [YC164-JR-0733RL]  17.07,69.47 270 top
R126  YC164-JR-0733RL  [YC164-JR-0733RL]  17.07,65.55 270 top
R127  200K  [0402]  14.87,41.27 90 top
R128  200K  [0402]  14.74,51.62 90 top
R129  200K  [0402]  14.74,72.62 90 top
R130  200K  [0402]  14.87,62.27 90 top
REF/2  TP  [TP]  19.37,29.82 225 top
REFBY2  TP  [TP]  53.25,26.95 180 top
REFOUT  TP  [TP]  56.9,11.85 180 top
SD1  [MICROSD]  74.45,6.2 0 top
SPI1_CS0  TP  [TP]  81.65,43.65 90 top
SW1  1825027-8  [SW2_1825027-C_TEC]  147.3,1.3 0 top
SYNC  TP  [TP]  28.57,77.48 270 top
T2  IRLML5203  [MICRO3]  57.81,78.75 270 top
TP9  TP  [TP]  15.1,13.25 180 top
TP-5VHD  TP  [TP]  46.4,92.2 0 top
TP-5VP  TP  [TP]  138,37 180 top
TP-BTN  TP  [TP]  124.3,37 270 top
TP-GREF  TP  [TP]  149.1,97.8 0 top
TP-LED  TP  [TP]  146.4,52.6 90 top
TP-LX  TP  [TP]  144,34 180 top
TP-M2CLK  TP  [TP]  151,11 180 top
TP-M2FB  TP  [TP]  140.5,22 270 top
TP-VBAT  TP  [TP]  33.7,85.4 0 top
TP-VBUS  TP  [TP]  89.3,14.5 90 top
TP-VM2  TP  [TP]  150.5,37.5 180 top
TP-VSD  TP  [TP]  79.8,18.1 90 top
TP_3V3  TP  [TP]  38.36,31.11 0 top
TP_5VP  TP  [TP]  66.7,89.5 0 top
TP_BSW_G  TP  [TP]  50.73,68.89 270 top
TP_GND  TP  [TP]  29.2,31.2 0 top
TP_VFB_14VN  TP  [TP]  46.82,65.75 90 top
TP_VFB_14VP  TP  [TP]  59.2,55.88 270 top
TP_VREF_TPS  TP  [TP]  48.86,65.72 90 top
TPD0  TP  [TP]  26.71,55.2 90 top
USB3  692141030100  [692141030100]  107.3,6.5 0 top
USBC  629722000214  [629722000214]  35,97.4 180 top
VCOMB  TP  [TP]  50.8,22.9 90 top
VFB12VN  TP  [TP]  55.95,26.37 0 top
VFB12VP  TP  [TP]  66.09,26.49 0 top
VOCMA  TP  [TP]  26.05,32.3 0 top
VREF_DAC  TP  [TP]  26.96,68.81 270 top
VREFR  TP  [TP]  20.45,55.15 90 top
X2  CRYSTAL  [OSCCC500X320X130]  150.9,17.5 0 top

## Tracks (layer width: path | path; a pad name or v marks a point on that pad's centre or on a via)
!ADC_RST
  Top 0.203: IC10.26 63.06,21.36 63.45,21.75 63.45,23.45 63.15,23.75 | 63.15,23.75 63,23.75 R16.2 | R38.1 68.12,26.22 68,26.22 67.29,25.52 65.6,25.52 63.83,23.75 63.15,23.75
!DIO_LEVEL_SELECT
  Top 0.203: IC38.3 7.07,53.38 6.72,53.03 4.73,53.03 IC39.4
!MISO_SEL
  Top 0.203: IC16.3 66.75,23.05 67.15,23.45 68.55,23.45 69.25,24.15 IC17.4
+1V8
  Top 0.16: J2.90 129.28,82.4 129.26,82.4 | J2.88 129.26,82.04
  Top 0.2: 129.26,82.44 129.26,82.4 129.26,82.2 129.26,82.04
  Top 0.508: 129.26,82.2 129.21,82.25 127,82.25 126.79,82.04 125.41,82.04 124.7,82.75 124.7,84.8 128.5,88.6 136,88.6 137.05,89.65 R7.1
+3V3  (via drill 0.15)  (9 unrouted)
  Top 0.16: J2.86 129.26,81.64 | J2.84 129.26,81.24
  Top 0.2: 129.26,81.64 129.26,81.45 129.26,81.24
  Top 0.203: 32.31,56.88 C128.1 33.77,56.74 34.11,57.09 34.11,58.81 33.84,59.08 IC24.2 | 39.92,57.13 C131.1 41.58,56.88 41.88,57.17 41.88,58.73 41.55,59.06 IC25.2 | 32.28,49.05 C134.1 33.74,48.85 33.76,48.87 34.12,49.23 34.12,50.94 33.95,51.1 IC26.2 | 39.94,48.95 C137.1 41.52,48.77 41.77,49.02 41.77,50.88 41.59,51.08 IC27.2 | C140.1 v33.23,40.73 33.73,40.73 34.14,41.15 34.14,42.8 33.95,42.99 IC28.2 | C143.1 41.45,40.73 41.78,41.05 41.78,42.73 41.52,43.01 IC29.2 | C146.1 33.88,32.85 34.16,33.15 34.16,34.85 33.91,35.12 IC30.2 | C149.1 v41.05,32.73 41.42,32.73 41.67,32.98 41.67,34.87 41.5,35.05 IC31.2 | C126.1 v32.7,65.62 | IC32.2 11.46,40.75 C152.1 C151.1 9.57,40.95 v9.53,41 | 11.62,49.9 C156.1 v8.75,49.9 | C168.1 C167.1 | C167.1 5.66,45.52 5.87,45.52 8.7,48.35 IC33.2 11.52,49.79 C155.1 | IC36.8 4.61,44.8 4.61,45.4 C167.1 | C159.1 11.53,61.95 | 11.53,61.95 C160.1 9.63,61.95 v9.47,61.8 | IC34.2 11.46,61.88 11.53,61.95 | C164.1 10.41,70.89 C163.1 11.52,70.79 IC35.2 8.71,69.36 5.88,66.53 5.65,66.53 C169.1 | C169.1 C170.1 | IC37.8 4.73,65.68 4.73,66.51 C169.1 | IC39.5 2.7,54.84 C171.1 | IC38.1 v8.07,52.55 IC38.8 8.07,50.21 8.38,49.9 8.5,49.9 | IC9.7 43.8,15.77 C51.1 43.77,15.34 C50.1 44.73,14.18 v44.95,13.95 | IC7.7 25.75,25.84 C65.1 26,27.25 C64.1 | IC10.12 61.56,15.16 61.25,14.85 v61.25,14.5 61.25,14 61.5,14 C25.1 | 61.2,22 61.2,22.15 C22.1 R16.1 62.91,22.25 62.91,21.8 62.06,20.96 IC10.28 IC10.29 61.56,21.14 61.2,21.5 61.2,22 | 61.2,22 61.65,22 61.85,21.8 | C21.1 66.16,24.66 IC17.5 | C45.1 22.68,58.73 C47.1 22.38,56.05 23.25,55.18 23.25,53.7 | 23.25,53.7 23.05,53.5 23.05,52.5 IC13.2
  Top 0.203: C49.1 25.34,53.01 24.65,53.7 23.25,53.7 | 61.8,21.1 v61.8,21.25 | v65.8,14.3 66.61,14.3 67.75,15.44 IC16.8 | J3.22 107.6,42.55 107.98,42.92 v108.75,42.92
  Top 0.221: IC22.3 33.88,71.44 33.62,71.69 33.62,71.84 | 33.62,71.84 33.62,75.34 34.05,75.77 R86.8 R86.7 R86.6 R86.5 | C123.1 32.3,71.84 32.39,71.75 C122.1 | C122.1 31.66,71.84 v31.66,70.67 | C122.1 33.62,71.84 | IC23.2 C126.1 | 34.16,33.15 34.98,33.15 v35.21,33.37 | C134.1 33.09,48.85 v33.22,48.98 | C128.1 32.51,56.8 v33.22,56.8 | C131.1 40.19,56.42 39.89,56.13 34.38,56.13 33.77,56.74 | C137.1 40.12,48.23 39.84,47.95 34.66,47.95 33.76,48.87 | C143.1 40.08,40.05 39.86,39.84 34.63,39.84 33.73,40.73 | 8.5,49.9 v8.75,49.9 | IC1.5 74.85,22.35 v74.8,22.4 | v70.35,27.1 69.1,25.85 68.15,25.85 67.35,25.05 IC17.5
  Top 0.254: v108.1,92.92 v108.1,86.01
  Top 0.286: IC11.2 22.62,36.52 22.2,36.1 20.75,36.1 C76.1
  Top 0.305: v35.21,33.37 37.48,31.11 TP_3V3.TP | C171.1 2.8,55.3 v4.6,57.1 | v120.25,39.84 121.67,38.41 121.67,29.73 v121.7,29.7
  Top 0.4: TP_3V3.TP 42,31.11 v42.65,31.75 | v29.25,28.2 28.8,28.65 26.25,28.65 25.8,28.2 C64.1 | IC11.2 22.62,38.23 v22.55,38.3
  Top 0.406: v123.4,84 123.9,84 | C9.1 145.85,44.75 145.6,44.5 v142.4,44.5
  Top 0.508: R6.1 135.5,89.95 v135.1,89.55 128.35,89.55 123.9,85.1 123.9,84 123.9,82.4 125.1,81.2 126.95,81.2 127.2,81.45 129.26,81.45 | IC3.5 146.05,45.7 C9.1 | 61.8,21.5 61.55,21.75 61.5,21.75 61.5,21.55 v61.8,21.25 | 61.8,20.75 61.8,21.1 62.65,21.95 62.65,22.15 61.9,22.15 61.85,22.1 61.85,21.75 62.05,21.75 62.15,21.85
  Top 0.813: GPIO.1 72.13,78.03 71.4,77.3 71.4,59 72.69,57.71 GPIO.17 | v140.8,39.7 140.75,39.65 140.75,35.5 139.08,33.83 v139.08,27.4 | v143.31,2.84 143.75,2.4 LED1.A | v157.5,1.3 LED2.A
  Route2 0.4: v42.65,31.75 42.45,31.55 42.45,26.6 | v44.95,13.95 42.45,16.45 42.45,26.6 | v29.25,28.2 30.08,27.37 36.26,27.37 37.03,26.6 42.45,26.6
  Route2 0.9: v31.66,70.67 36.81,70.67 37.92,69.57 53.17,69.57 56.9,73.3 67.45,73.3 69.55,71.2 69.55,59.35 71.19,57.71 GPIO.17
  Route15 0.305: v9.47,61.8 10.9,60.37 12.89,60.37 18.39,65.87 18.39,66.27 19.33,67.21 19.82,67.21 20.16,66.87 20.16,60.65 C47.1
  Route15 0.9: v41.05,32.73 44.53,32.73 47.6,35.8 53.75,35.8 58.95,41 65.5,41 68.55,37.95 68.55,27.05 C21.1 62.75,21.25 v61.8,21.25
  Bottom 0.203: v9.53,41 9.53,41.7 5.24,45.98 C167.1 | v9.47,61.8 9.47,62.5 5.2,66.78 C169.1 | v44.95,13.95 59.5,13.95 | 59.5,13.95 60.7,13.95 v61.25,14.5 64.02,14.5 64.37,14.85 65.25,14.85 v65.8,14.3 | v61.8,21.25 61.2,21.25 59.5,19.55 59.5,13.95 | J4.22 106.33,92.92 v108.1,92.92 R61.2
  Bottom 0.221: v33.23,40.73 33.22,40.72 33.22,40.44 | v74.8,22.4 70.35,26.85 v70.35,27.1
  Bottom 0.305: C47.1 24.84,60.9 33.22,60.9 | v8.75,49.9 9.56,50.7 9.56,52.28 14.04,56.76 19.24,56.76 19.26,56.75 24.26,56.75 26.64,54.37 33.05,54.37 33.22,54.2 | v4.6,57.1 8.07,53.63 v8.07,52.55 | v108.75,42.92 111.96,39.72 120.13,39.72 v120.25,39.84 | v121.7,29.7 121.7,27.88 122.83,26.74
  Bottom 0.4: v22.55,38.3 29.95,38.3 30.45,38.8 33.02,38.8 33.22,38.6
  Bottom 0.813: GPIO.1 73.13,81.13 74.8,82.8 86.2,82.8 89.41,86.01 v108.1,86.01 121.59,86.01 123.4,84.2 v123.4,84 | v135.1,89.55 138,86.65 138.45,86.65 140.65,84.45 140.65,60.85 143.03,58.47 143.03,46.67 142.4,46.04 v142.4,44.5 142.4,41.3 v140.8,39.7 | v143.31,2.84 142.28,3.88 142.28,8.15 | 142.28,8.15 142.28,23.43 139.08,26.62 v139.08,27.4 139.07,27.39 131.84,27.39 | ETH1.20 122.25,26.16 122.83,26.74 123.48,27.39 131.84,27.39 | ETH1.18 131.89,27.34 131.84,27.39 | 142.28,8.15 152.4,8.15 157.1,3.45 157.1,1.7 v157.5,1.3
  Bottom 1.016: v41.05,32.73 41.03,32.74 35.84,32.74 v35.21,33.37 33.22,35.37 33.22,38.6 33.22,40.44 v33.22,48.98 33.22,54.2 v33.22,56.8 33.22,60.9 33.22,65.11 v32.7,65.62 31.66,66.67 v31.66,70.67
  other vias: 5.2,45.98 5.2,66.98 22.38,58.44 65.85,24.35
+3V3_EXT
  Top 0.813: J7.67 52.06,3.19 51.45,2.58 34.45,2.58 J7.52 | 5.25,23.65 IC18.4 2.75,16.4 C27.1 | 5.25,23.65 IC18.2 | 5.25,23.65 5.2,23.6 5.2,20.25
  Top 0.865: C121.1 6,19.45 5.2,20.25
  Top 0.9: 34.45,2.58 32.92,1.05 9.85,1.05 7.7,3.2 7.7,9.2 2.86,14.04 2.86,16.21 C27.1
+5V  (via drill 0.15)  (4 unrouted)
  Top 0.16: 89.96,8.42 90.47,8.42 C5.1 | J2.77 132.3,80.04 | 132.15,80.44 J2.79 132.3,80.44 | J2.81 132.2,80.84 | J2.83 132.15,81.24 | J2.85 132.3,81.64 | J2.87 132.35,82.04
  Top 0.2: 133.86,80.04 v134.54,79.36
  Top 0.203: 132.02,81.24 132.15,81.24 v134.54,81.24 | 132.02,81.64 132.3,81.64 134.34,81.64 v134.54,81.84 | 132.02,80.84 132.2,80.84 134.32,80.84 v134.54,80.62 | 132.02,80.44 132.15,80.44 132.3,80.44 134.08,80.44 v134.54,79.98 | 132.02,80.04 132.3,80.04 133.86,80.04 | 132.02,82.04 132.35,82.04 134.12,82.04 v134.54,82.46 | IC38.5 6.57,50.31 v6.48,50.23 | v90.54,8.38 90.54,7.86 90.6,7.8 | 89.96,8.42 90.6,7.78 v90.6,6.7 | v64.4,89.3 64.6,89.5 TP_5VP.TP
  Top 0.221: IC14.5 56.07,69.25 IC14.6
  Top 0.254: IC5.3 146.35,26.35 145.72,25.72 145.2,25.72 | v143.55,25.55 143.84,25.26 143.84,25.16 143.91,25.16 v144.3,25.55 v145.1,25.55
  Top 0.286: USBC.A9 USBC.B4 32.6,92.5 | USBC.A4 USBC.B9 37.31,92.66 37.4,92.57 | T2.2 56.05,77.8 v56.02,77.78
  Top 0.305: v90.54,10.08 91.22,10.08 91.35,9.95 | 36.27,83.31 36.01,83.31 35.89,83.43
  Top 0.406: IC2.1 91.55,10.15 91.35,9.95 C5.1 | v35.48,83.84 35.89,83.43 v35.89,83.28 | C120.1 11.68,26.45
  Top 0.508: C20.1 143.3,25.2 143.3,25.54 143.48,25.72 145.2,25.72 145.36,25.56 145.36,21.08 145.02,20.74 144.36,20.74 144.22,20.88 144.22,24.36 143.94,24.64 C20.1 | C20.1 143.73,24.65 143.84,24.76 144.2,25.12 | 56.07,69.25 56.07,70.55 55.64,70.98 51.01,70.98 50.57,71.42 50.57,76.35 51.18,76.96 54.58,76.96
  Top 0.61: C2.1 32.2,90.8 32.6,91.2 | 32.6,92.5 32.6,91.2 | 37.4,92.57 37.4,91.3 37.73,90.97 | 37.73,90.97 38,90.7 C1.1 R1.1 | IC4.1 42.25,94.9 C3.1 | 32.6,91.2 32.6,90.72 v32.72,90.6 | v37.34,90.64 37.67,90.97 37.73,90.97 | v20.93,73.1 20.93,74.2 28.23,81.5 33.83,81.5 35.16,82.83 35.16,83.09 | J7.33 52.91,8.88 53.78,8.88 55.9,6.76 v55.9,3.45
  Top 0.813: IC4.1 v43.35,89.66 | 11.53,24.98 11.53,27.84 C120.1 11.2,28 11.12,28.07
  Top 0.865: 11.12,28.07 9.96,29.23 | 11.12,25.38 10.55,25.95 IC18.3
  Top 0.9: C18.1 144.82,24.53 144.82,25.16 143.84,25.16 | 143.84,25.16 143.84,24.76 | 143.84,25.16 144.78,24.22 144.78,21.46 144.74,21.42 | 144.74,21.42 144.74,21.34 | 144.74,21.42 144.74,21.69 C19.1 | C85.1 54.58,76.96 54.58,77.28 v55.1,77.8 T2.2 57.53,77.08 57.53,75.55 57.43,75.45 57.37,75.51 55.36,75.51 55.36,76.72 55.31,76.77 55.56,77.02 56.75,77.02 56.93,76.84 56.93,76.32 55.92,76.32 55.81,76.43 55.81,76.2 56.09,76.2 R14.2 | 11.12,25.38 11.53,24.98 13.6,22.9 13.6,17.2 9.75,13.35 9.75,3.6 11.05,2.3 32.15,2.3 v32.3,2.45 | 9.96,29.23 9.8,29.39 C26.1
  Top 1.27: 143.3,25.2 139.5,25.2 137.8,26.9 137.8,34.65 138.05,34.9 v138.05,43.7 138.99,44.64 CON1.4 | GPIO.4 GPIO.2 75.67,79.86 74.14,81.39 38.19,81.39 36.27,83.31 v36.27,83.81 36,84.08 35.16,83.24 35.16,83.09 35.44,82.81 36.39,82.81
  Top 2: 90.6,7.8 90.6,10.74 90.64,10.78 90.68,10.74 90.82,10.74 90.82,10.3 90.68,10.44 90.68,10.78 89.96,10.78 89.96,8.42 90.58,7.8
  Route2 0.61: v6.48,50.23 6.98,50.73 6.98,56.53 13.31,62.88 v13.55,62.88
  Bottom 0.203: v134.54,82.46 134.54,83.18 134.94,83.18 | v134.54,81.24 v134.54,81.84 134.54,81.88 134.94,81.88 | v134.54,80.62 134.54,80.74 134.94,80.74 134.94,79.98 v134.54,79.98
  Bottom 0.305: v89.64,10.1 v89.64,11 v90.52,11 | v89.64,10.1 89.66,10.08 v89.66,9.26 v89.66,8.42 89.7,8.38 v90.54,8.38 | v90.54,10.08 90.52,10.1 v89.64,10.1
  Bottom 0.61: v32.72,90.6 37.3,90.6 v37.34,90.64 | v13.55,62.88 18.18,67.5 19.98,67.5 20.93,68.45 v20.93,73.1 | J7.18 32.3,7.11 32.3,6.94 32.86,6.38 32.86,5.45 31.9,4.48 31.9,3.55 32.3,3.14 v32.3,2.45 | 49.15,0.85 53.35,0.85
  Bottom 0.9: 65.82,3.87 65.12,3.87 63.45,2.2 55.95,2.2 55.9,2.25 v55.9,3.45 55.9,0.85 53.35,0.85 45.89,0.85 | v32.3,2.45 37.45,2.45 39.05,0.85 45.89,0.85 | 45.89,0.85 45.91,0.83
  Bottom 1.27: v138.05,43.7 138.05,54.35 138.6,54.9 | 138.6,54.9 140.88,54.9 | 138.6,54.9 139.45,55.75 139.45,83.95 137.95,85.45 134.94,85.45 | 55.2,81.23 55.1,81.13 v55.1,77.8 55.27,77.62 56.05,77.62
  Bottom 1.8: 134.94,83.18 134.94,85.45 134.94,87.18 132.82,89.3 v64.4,89.3 46.86,89.3 45.52,90.64 v37.34,90.64 37.34,89.66 v43.35,89.66 45.38,89.66 46.78,88.26 50.77,88.26 131.9,88.26 133.94,86.22 133.94,79.88 134.94,79.88 134.94,80.74 134.94,81.88 134.94,83.18 | 134.94,83.18 134.4,83.18 134.32,83.26
  Bottom 1.9: 89.5,2.72 66.97,2.72 65.82,3.87 65.82,8.83 68.47,11.48 68.47,79.67 66.91,81.23 55.2,81.23 53.42,81.23 50.77,83.88 50.77,88.26
  Bottom 2: v37.34,90.64 37.34,84.88 v36.27,83.81 | 89.5,2.72 90.6,3.82 v90.6,6.7 90.6,7.8 89.92,8.48 89.92,10.8 90.88,10.8 90.88,8.46 90.86,8.44
  other vias: 34.95,83.31 35.39,82.82
+12V  (via drill 0.15)  (4 unrouted)
  Top 0.203: IC15.10 62.44,36.55 63.2,36.55 | 12VP.TP 67.78,31.67 67.78,35.38 | IC9.26 47.08,20.9 | 47.08,20.9 47.08,21.33 47.44,21.68 C53.1 48.89,22.16 C52.1 | IC7.26 22.36,20.86 21.98,20.48 C67.1 20.88,20.17 C66.1 | IC8.14 38.05,22.25 v37.8,22 | v47.35,20.99 47.17,20.99 47.08,20.9 | IC6.14 31.32,18.09 30.95,18.45 29.96,18.45 28.89,19.52 v28.64,19.52 28.64,19.26 27.61,18.22 26.48,18.22 25.8,18.9 v25.8,20.1 | v63.5,35.15 63.5,35.39 63.5,35.4
  Top 0.221: IC6.14 31.32,16.81 31.04,16.54 C61.1 31.04,14.64 30.65,14.26 | IC8.14 38.05,24.09 38.42,24.47 C57.1 38.42,26.46 C56.1
  Top 1.27: 66.58,35.38 67.78,35.38 68.3,35.9 68.3,37.4 68.2,37.5 67.1,37.5 67,37.4 67,36.3 66.7,36 63,36 63,35.9 63.5,35.4 64.47,35.4 64.49,35.38 R60.1 66.58,35.38 | 66.58,35.38 67.5,36.3
  Route15 0.813: v63.5,35.95 v63.5,35.15 63.5,32.45 62.75,31.7 48.2,31.7 45.8,29.3 42.15,29.3 | 42.15,29.3 26.8,29.3 22.95,25.45 22.95,20.65 22.47,20.17 C67.1 | v47.35,20.99 45.04,23.3 42.95,23.3 42.15,24.1 42.15,29.3
  Bottom 0.203: v47.35,20.99 47.35,20.81 46.95,20.41 40.59,20.41 40,21 38.8,21 v37.8,22 37.54,22.26 34.06,22.26 32.3,20.5 31.7,20.5 31.43,20.77 29.65,20.77 28.9,20.02 28.9,19.78 v28.64,19.52 | C67.1 25.73,20.17 v25.8,20.1
  other vias: 21.98,20.17
+14V
  Top 0.16: 65.75,46.75 65.73,46.73 65.73,46.48
  Top 0.203: IC14.23 63.1,68.07 | 63.1,68.07 C100.1 64.8,66.37 R19.1 66.41,66.42 | D3.C 66.41,68.07 66.41,67.95 66.41,66.42 | 63.1,68.07 63.54,68.07 63.83,68.36 63.83,69.59 64.4,70.16 67.52,70.16 67.81,69.87 67.81,69.43 67.81,66.61 67.55,66.35 66.49,66.35 66.41,66.42 | IC15.2 IC15.1 62.3,39.22 62.3,39.5 | 14VP.TP 66.6,43.15 66.55,43.15
  Top 0.9: 66.41,67.95 67.13,67.95 67.25,68.07 | 67.24,67.37 67.24,69.59 67.29,69.64 67.29,66.87 | 67.29,66.87 67.14,66.72 67.09,66.77 65,66.77 64.1,67.67 64.1,67.88 63.85,67.88 | 63.85,67.88 63.82,67.85 | 63.85,67.88 64.34,68.37 64.34,69.33 64.71,69.7 65.28,69.7 64.68,69.1 64.68,67.8 65.16,67.32 66.58,67.32 66.58,68.31 66.56,68.33 66.5,68.27 65.04,68.27 65.55,67.76 65.88,67.76 | 65.88,67.76 65.88,68.23 65.03,69.08 65.03,69.06 | 65.88,67.76 66.19,68.07 66.41,68.07 | 67.29,66.87 67.63,66.53 67.63,56.94 | 67.63,56.94 65.73,55.04 65.73,46.48 66.15,46.48 C95.1 67.03,46.5 68.32,46.5 68.32,68.92 67.81,69.43 | 67.63,56.94 67.63,47.31 67.42,47.1 67.06,47.46 67.06,50.16 | 67.06,50.16 67.06,52.9 | 67.06,52.9 67.06,55.59 66.5,55.03 66.5,47.77 66.61,47.66 C94.1 66.79,50.16 67.06,50.16 | C93.1 66.95,52.9 67.06,52.9 | 64.45,43.1 64.6,43.1 66.85,45.35 66.85,43.95 66.1,43.95 64.65,42.5 63.95,42.5 63.85,42.4 64,42.25 64,41.3 64.2,41.3 66.05,43.15 66.55,43.15 67.4,43.15 67.5,43.25 67.5,45.95 66.6,45.95 63.2,42.55 63.2,41.05 63.3,41.05 63.95,40.4 63.4,40.4 62.5,39.5 62.3,39.5 62.3,39.6 62.7,40 62.7,42.7 65.75,45.75 65.75,46.75 65.85,46.85 68.3,46.85 68.3,42.8 68.1,42.6 66.15,42.6 65.2,41.65 65.2,40.75 65.09,40.64 C104.1
-12V  (via drill 0.15)
  Top 0.203: 59.1,36 59.1,36.55 60.44,36.55 60.44,36.35 | IC15.6 60.44,36.35 | 59.8,36 60.15,36.35 60.44,36.35 | R76.2 54.97,35.73 55.12,35.73 | 12VN.TP 52.5,32.44 52.5,35.15 52.82,35.47 C106.1 | C58.1 38.39,14.55 C59.1 38.39,16.36 38.05,16.7 IC8.3 38.05,18.25 38.37,18.57 38.61,18.57 38.64,18.6 39.2,18.6 40.5,19.9 40.5,21.3 40.47,21.33 v40.43,21.33 | IC9.29 46.58,18.27 IC9.27 46.58,21.32 46.27,21.64 C55.1 45,22.15 C54.1 44.14,21.3 v43.7,21.3 | IC7.29 22.86,23.34 IC7.27 22.86,21.04 23.23,20.66 C69.1 24.32,20.19 C68.1 24.5,20.66 v25,21.15 | v57.15,35.55 57.1,35.6 57.1,36
  Top 0.221: IC6.3 31.32,24.39 C63.1 30.97,26.14 C62.1
  Top 0.61: 54.25,35.47 54.63,35.47 R76.2 | 53.8,37.7 53.6,37.7 53.31,37.41 C106.1 53.8,35.47 | 53.8,37.7 54.25,37.7 | 54.3,37.75 54.25,37.7 | 54.25,37.7 54.25,35.47 | 54.25,35.47 53.8,35.47 | 53.8,35.47 53.8,37.7
  Top 1.27: C109.1 55.12,35.73 55.15,35.7 59.8,35.7 59.9,35.8 59.8,35.9 59.8,36 59.1,36 57.1,36 56,36 55.4,36.6 55.5,36.6
  Route2 0.813: IC9.29 47.58,19.42 43.45,23.55 v43.45,24.7
  Bottom 0.203: v43.7,21.3 43.53,21.13 40.63,21.13 v40.43,21.33 40.18,21.33 40.15,21.36 39.04,21.36 38.34,22.06 38.34,22.22 37.93,22.63 31.68,22.63 31.3,23 | 31.3,23 30.97,23.34 C63.1 | v25,21.15 25.44,20.71 27.45,20.71 29.15,22.41 30.71,22.41 31.3,23
  Bottom 0.813: v57.15,35.55 v56.3,35.55 50.1,35.55 45.3,30.75 43.35,30.75 | 43.35,30.75 25.85,30.75 21.86,26.76 IC7.29 | v43.45,24.7 43.45,30.65 43.35,30.75
  other vias: 30.97,24.73 21.86,24.34 47.58,17.27
-14V  (2 unrouted)
  Top 0.16: 58.05,57.25 58.02,57.28 57.9,57.28
  Top 0.203: IC14.15 56.81,64.53 56.41,64.13 55.75,64.13 55.75,60.97 56.91,59.81 56.91,58.59 57.14,58.36 | 57.14,58.36 57.19,58.31 | 57.14,58.36 57.82,58.36 R59.2 59.08,58.38 C101.1 | 57.9,56.14 57.9,56.23 | IC15.5 59.65,39.08 59.65,39.25 59.65,39.3 | 60.45,39.25 60.45,38.8 59.4,38.8 59.4,39.15 | 14VN.TP 56.88,43.08 57.2,43.4
  Top 0.508: 57.9,57.28 57.9,56.23 | 57.92,57.75 58.05,57.62 58.05,57.25 58.05,56.23
  Top 0.813: 57.9,50.42 57.9,56.14 54.87,56.14 53.62,54.89 53.62,53.7 53.91,53.7 D4.A 53.98,53.05 53.57,53.05 53.57,46.72 54.63,45.66 56.6,45.66 57.53,45.66 57.93,46.06 57.93,50.39 57.9,50.42 | 57.2,55.45 57.2,46.66 56.79,46.25 56.54,46.5 56.54,55.62 55.87,55.62 55.8,55.69 55.8,46.42 56.04,46.18 | 56.06,46.16 56.04,46.18 | 56.04,46.18 55.38,46.18 55.38,55.29 55.22,55.45 55.17,55.4 54.78,55.4 54.78,46.14 | 54.78,46.14 54.83,46.09 | 54.78,46.14 54.44,46.48 54.19,46.48 54.19,54.84 54.32,54.97 | C97.1 57.71,50.61 57.9,50.42 | C96.1 57.69,46.93 C98.1 | 59.05,58.31 57.19,58.31 56.48,58.31 56.08,57.91 56.08,56.8 57.38,56.8 57.85,57.28 | 57.51,56.23 57.9,56.23 | 59.14,57.72 56.84,57.72 56.68,57.56 56.68,57.28 57.9,57.28
  Top 0.9: 58.2,42.65 60.1,40.75 60.1,39.25 59.65,39.25 | 59.65,39.3 58.85,40.1 58.85,40.35 58.8,40.35 58.8,41.35 | 58.8,41.35 59.6,40.55 59.6,40.3 | 57.4,41 57.76,40.64 C102.1 58.09,40.64 58.8,41.35
  Top 1.27: C98.1 57.74,45.08 58.04,44.78 58.04,40.91 C102.1 | 54.78,46.14 54.78,45.82 57.2,43.4 | 57.4,41 57.4,43.2 57.2,43.4 | 57.2,43.4 57.2,44.1 56.3,45 56.4,45.1 56.9,45.1 56.9,45.36 56.6,45.66
ADA_A_IO0  (via drill 0.15)
  Top 0.203: IC6.1 32.62,22.36 32,21.75 v31.85,21.75 | IC7.18 15.13,24.34 v15.11,24.35
  Bottom 0.203: v31.85,21.75 31.65,21.55 29.36,21.55 26.97,19.16 20.07,19.16 15.11,24.12 v15.11,24.35
ADA_A_IO1  (via drill 0.15)
  Top 0.203: IC7.17 15.39,24.84 15.34,24.89 15.11,24.89 v14.94,25.06 | v31.95,21.04 32.62,20.37 IC6.16
  Bottom 0.203: v14.94,25.06 14.94,24.93 14.58,24.57 14.58,24.13 19.9,18.8 27.16,18.8 29.5,21.14 31.85,21.14 v31.95,21.04
ADA_A_IO2  (via drill 0.15)
  Top 0.203: IC6.2 31.96,22.86 v31.2,22.1 | v15.6,25.4 15.66,25.34 IC7.16
  Bottom 0.203: v31.2,22.1 31.15,22.05 29.3,22.05 26.8,19.55 20.2,19.55 15.75,24 15.75,25.25 v15.6,25.4
ADA_B_IO0  (via drill 0.15)
  Top 0.203: IC8.1 36.74,18.55 37.5,19.3 38.21,19.3 39.35,20.45 v39.65,20.45 | v53.75,18.15 53.15,18.15 52.27,17.27 IC9.18
  Bottom 0.203: v39.65,20.45 40.2,19.9 49.1,19.9 51.55,19.9 53.3,18.15 v53.75,18.15
ADA_B_IO1  (via drill 0.15)
  Top 0.203: IC8.16 36.74,22 36.9,21.85 v36.9,21.73 | v53.33,17.57 53.08,17.57 52.41,16.9 51.95,16.9 51.81,16.77 IC9.17
  Bottom 0.203: v53.33,17.57 51.39,19.51 39.82,19.51 39.3,20.03 38.6,20.03 v36.9,21.73
ADA_B_IO2  (via drill 0.15)
  Top 0.203: IC8.2 37.39,18.68 37.65,18.94 38.46,18.94 38.89,19.37 v39.1,19.37 | v53.7,15.5 51.8,15.5 51.03,16.27 IC9.16
  Bottom 0.203: v39.1,19.37 39.38,19.1 51.29,19.1 52.79,17.59 52.79,17.35 53.11,17.03 53.35,17.03 53.7,16.68 v53.7,15.5
ADC_AIN_N
  Top 0.4: 55.35,21.27 54.91,21.27 C41.2 54.89,21.2 54.89,20.55 | 55.35,21.27 R46.1 55.92,20.7 | 54.89,20.14 R21.1 55.18,20.46 55.69,20.46 55.92,20.7 | 54.89,20.14 C24.2 | C24.2 55.92,20.7 | 54.89,20.55 54.89,20.14 | C24.2 55.93,20.7 55.61,21.01 | 55.61,21.01 55.35,21.27 | 55.61,21.01 55.35,21.01 | 55.35,21.01 54.89,20.55 | C24.2 55.35,20.71 55.35,21.01
ADC_AIN_P
  Top 0.4: R20.1 55.91,23.5 C23.1 55.63,23.22 55.63,22.83 | R20.1 54.95,23.05 | 54.95,23.05 54.95,22.61 C41.1 55.75,22.53 | 55.75,22.53 R45.2 | R45.2 55.91,23.25 | 55.91,23.25 55.91,23.49 55.9,23.5 | R20.1 55.63,22.83 | 55.63,22.83 55.75,22.7 55.75,22.53 | R45.2 55.23,23.05 54.95,23.05 | R20.1 55.2,23.25 55.91,23.25
ADC_BIN_N
  Top 0.4: R23.1 55.3,13.26 | 55.3,13.26 55.7,13.26 | 55.7,13.26 55.8,13.35 55.8,13.31 C43.2 55.88,13.84 | R48.2 55.88,14.37 55.88,13.85 55.88,13.84 | R48.2 55.8,14.3 C44.2 | C44.2 55,14.1 55,13.35 | C44.2 55.37,13.72 | 55.37,13.72 55.7,13.39 55.7,13.26 | R48.2 55.37,13.88 55.37,13.72 | 55.37,13.72 55.3,13.65 55.3,13.26 | 55.3,13.26 55.88,13.84
ADC_BIN_P
  Top 0.4: R22.1 55.4,16.66 | 55.4,16.66 55.83,16.66 C42.1 55.87,15.54 R47.1 | R47.1 55.5,15.53 | 55.5,15.53 54.87,15.53 C44.1 | C44.1 54.8,16 | 54.8,16 54.8,16.61 R22.1 | R22.1 55.5,15.99 55.5,15.53 | R47.1 55.38,16 54.8,16 | C44.1 55.77,15.6 R47.1 | R47.1 55.85,16.2 55.4,16.66
ADC_IN0
  Top 0.203: R45.1 57.44,22.15 57.9,22.15 58.46,21.59 58.46,20.4 59.05,19.82 IC10.1
ADC_IN1
  Top 0.203: IC10.2 58.98,19.32 58.1,20.2 58.1,20.9 57.73,21.27 R46.2
ADC_IN2
  Top 0.203: IC10.8 58.93,16.32 58,15.39 58,14.7 57.67,14.38 R48.1
ADC_IN3
  Top 0.203: R47.2 57.62,15.53 58.91,16.82 IC10.7
ADC_RDY  (via drill 0.15)
  Top 0.203: R36.1 66.5,28.1 v66.25,28.1 | v64.75,21.6 63.95,21.6 63.56,21.21 IC10.25
  Bottom 0.203: v66.25,28.1 66.25,24.71 66.39,24.57 66.39,23.24 v64.75,21.6
AO_0  (via drill 0.15)
  Top 0.203: R89.2 v31.02,61.66 | R89.2 v31.02,61.66 | v31.02,61.66 31.96,61.66 R90.2 33.31,61.69 C127.1 | 30.43,61.69 R89.2
  Route2 0.203: v31.02,61.66 32.86,61.66 36.83,57.69 37.52,57.69 37.83,57.38 37.83,56.69 38.52,56 43.35,56 50.15,49.2 50.15,12.37 47.51,9.72 J7.29
AO_1  (via drill 0.15)
  Top 0.203: R93.2 v38.65,61.63 39.51,61.63 39.52,61.62 | 39.52,61.62 R94.2 | C130.1 39.52,61.62
  Route2 0.203: v38.65,61.63 38.65,56.83 39.11,56.36 43.5,56.36 50.51,49.35 50.51,12.16 48.46,10.11 48.46,9.39 46.98,7.92 J7.63
AO_2  (via drill 0.15)